# EAGLE design Tema_proiect_v15 (EAGLE 9.7.0)
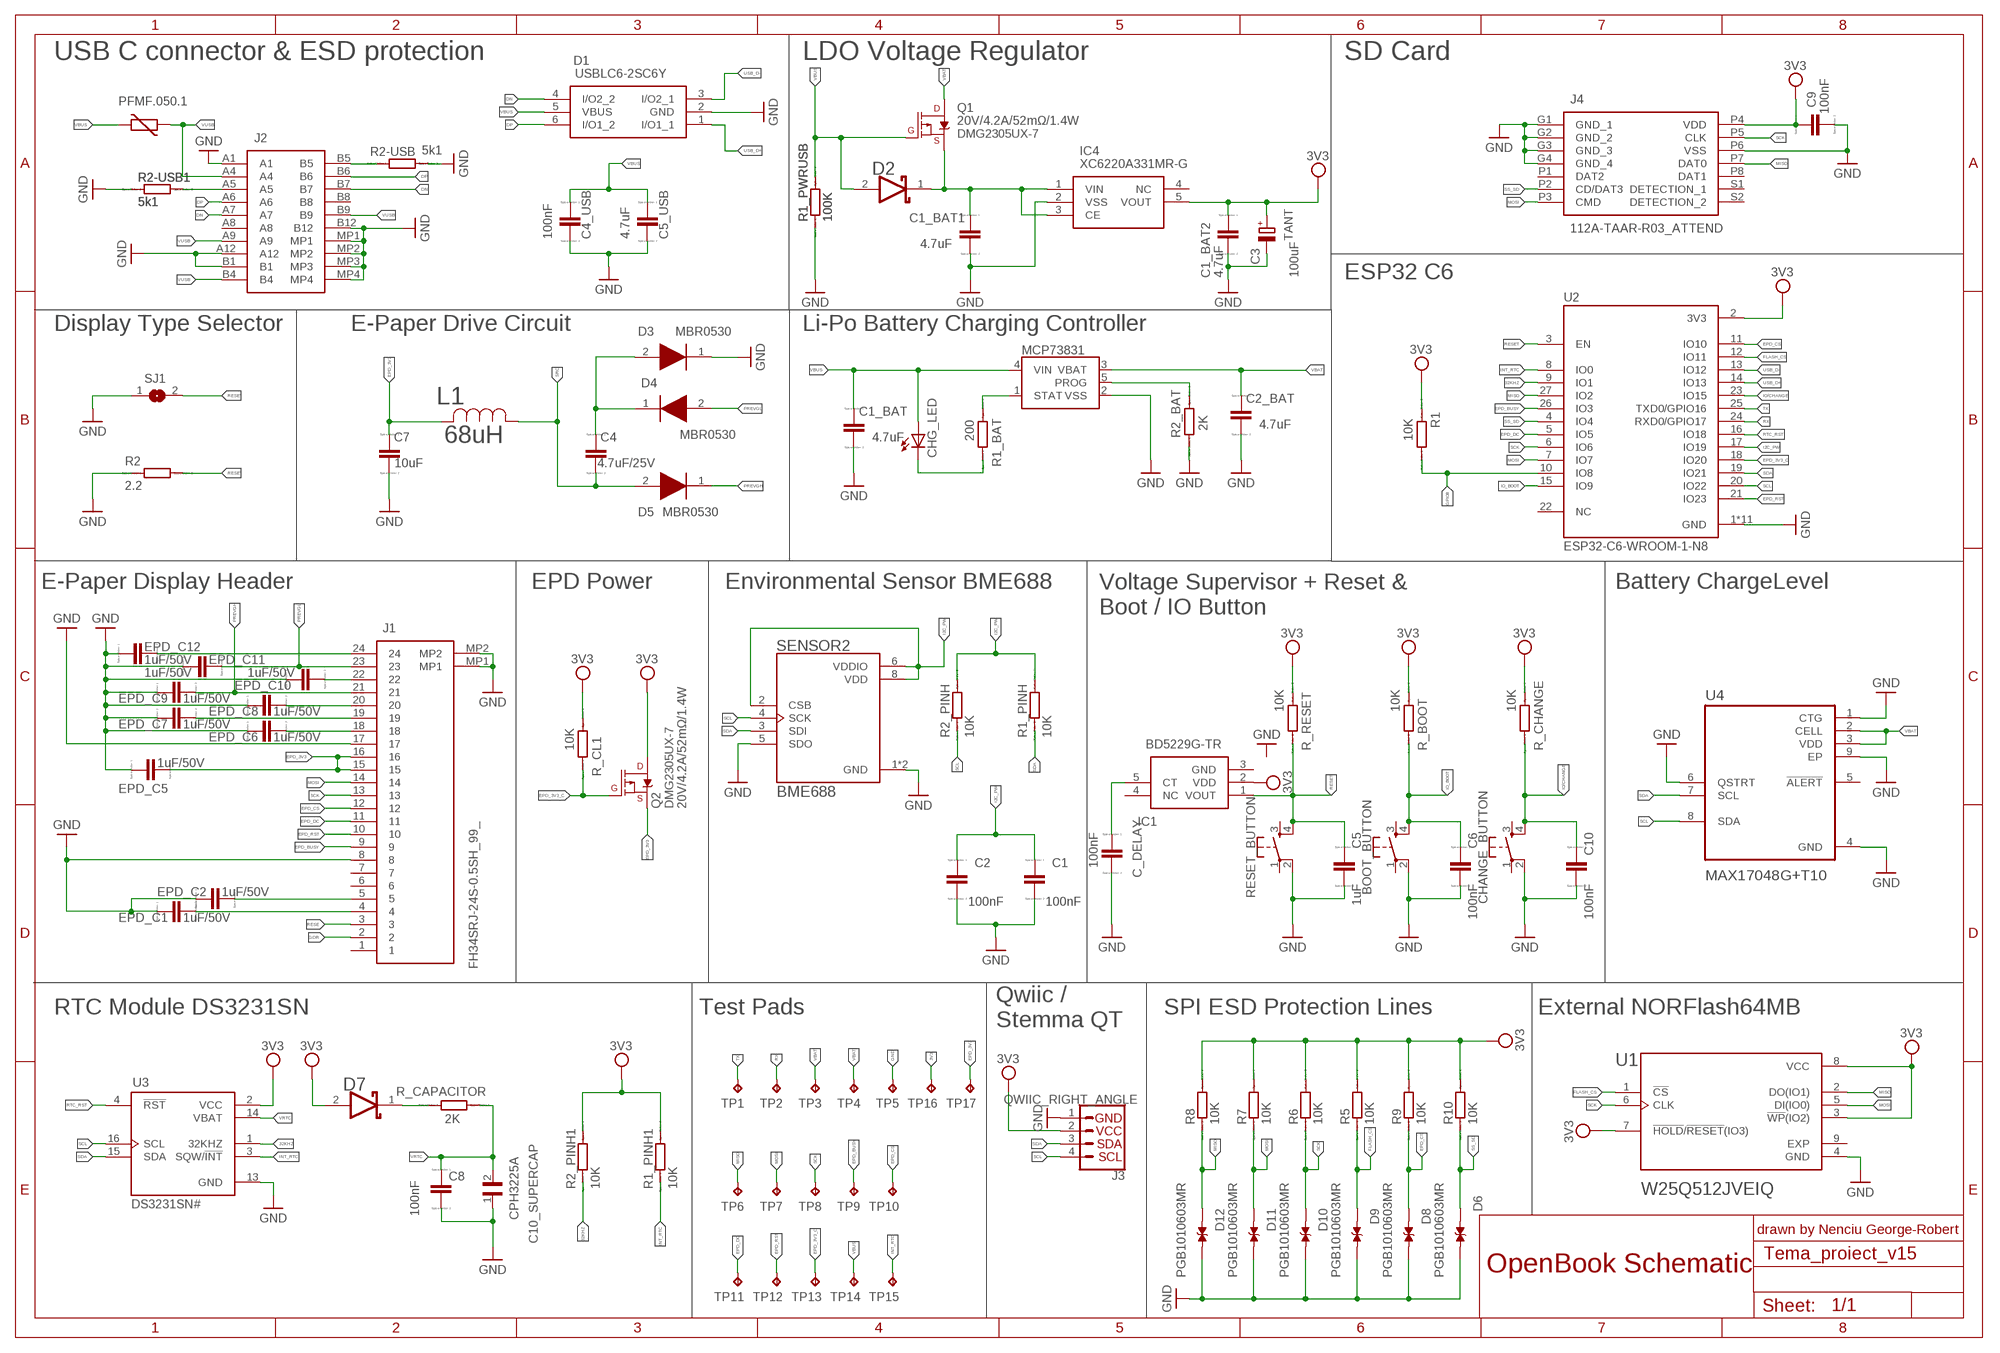
[diagram p0: schematic, sheet 1]

## Parts
BOOT_BUTTON  BUTTON_CUSYOMV1  [MYBUTTON]
C1  100nF  EAGLE-LTSPICE_CC0402  [EAGLE-LTSPICE_C0402]
C1_BAT  4.7uF  EAGLE-LTSPICE_CC0402  [EAGLE-LTSPICE_C0402]
C1_BAT1  4.7uF  EAGLE-LTSPICE_CC0402  [EAGLE-LTSPICE_C0402]
C1_BAT2  4.7uF  EAGLE-LTSPICE_CC0402  [EAGLE-LTSPICE_C0402]
C2  100nF  EAGLE-LTSPICE_CC0402  [EAGLE-LTSPICE_C0402]
C2_BAT  4.7uF  EAGLE-LTSPICE_CC0402  [EAGLE-LTSPICE_C0402]
C3  100uF  RCL_CPOL-EUCT3528  [RCL_CT3528]
C4  4.7uF/25V  EAGLE-LTSPICE_CC0402  [EAGLE-LTSPICE_C0402]
C4_USB  100nF  EAGLE-LTSPICE_CC0402  [EAGLE-LTSPICE_C0402]
C5  1uF  EAGLE-LTSPICE_CC0402  [EAGLE-LTSPICE_C0402]
C5_USB  4.7uF  EAGLE-LTSPICE_CC0402  [EAGLE-LTSPICE_C0402]
C6  100nF  EAGLE-LTSPICE_CC0402  [EAGLE-LTSPICE_C0402]
C7  10uF  EAGLE-LTSPICE_CC0402  [EAGLE-LTSPICE_C0402]
C8  100nF  EAGLE-LTSPICE_CC0402  [EAGLE-LTSPICE_C0402]
C9  100nF  EAGLE-LTSPICE_CC0402  [EAGLE-LTSPICE_C0402]
C10  100nF  EAGLE-LTSPICE_CC0402  [EAGLE-LTSPICE_C0402]
C10_SUPERCAP  CPH3225A  [CAPCP3225X100N]
C_DELAY  100nF  EAGLE-LTSPICE_CC0402  [EAGLE-LTSPICE_C0402]
CHANGE_BUTTON  BUTTON_CUSYOMV1  [MYBUTTON]
CHG_LED  ADAFRUIT_LEDCHIP-LED0603  [ADAFRUIT_CHIP-LED0603]
D1  USBLC6-2SC6Y  [SOT95P280X145-6N]
D2  ESP32_WROVER_AVX---SD0805S020S1R0_AVX_SD0805S020S1R0_0_0AVX_SD0805S020S1R0_0_0  [ESP32_WROVER_AVX---SD0805S020S1R0_AVX_SD0805S020S1R0_0]
D3  MBR0530  [SOD3716X135N]
D4  MBR0530  [SOD3716X135N]
D5  MBR0530  [SOD3716X135N]
D6  PGB1010603MR  [DIOC1608X36N]
D7  ESP32_WROVER_AVX---SD0805S020S1R0_AVX_SD0805S020S1R0_0_0AVX_SD0805S020S1R0_0_0  [ESP32_WROVER_AVX---SD0805S020S1R0_AVX_SD0805S020S1R0_0]
D8  PGB1010603MR  [DIOC1608X36N]
D9  PGB1010603MR  [DIOC1608X36N]
D10  PGB1010603MR  [DIOC1608X36N]
D11  PGB1010603MR  [DIOC1608X36N]
D12  PGB1010603MR  [DIOC1608X36N]
EPD_C1  1uF/50V  EAGLE-LTSPICE_CC0402  [EAGLE-LTSPICE_C0402]
EPD_C2  1uF/50V  EAGLE-LTSPICE_CC0402  [EAGLE-LTSPICE_C0402]
EPD_C5  1uF/50V  EAGLE-LTSPICE_CC0402  [EAGLE-LTSPICE_C0402]
EPD_C6  1uF/50V  EAGLE-LTSPICE_CC0402  [EAGLE-LTSPICE_C0402]
EPD_C7  1uF/50V  EAGLE-LTSPICE_CC0402  [EAGLE-LTSPICE_C0402]
EPD_C8  1uF/50V  EAGLE-LTSPICE_CC0402  [EAGLE-LTSPICE_C0402]
EPD_C9  1uF/50V  EAGLE-LTSPICE_CC0402  [EAGLE-LTSPICE_C0402]
EPD_C10  1uF/50V  EAGLE-LTSPICE_CC0402  [EAGLE-LTSPICE_C0402]
EPD_C11  1uF/50V  EAGLE-LTSPICE_CC0402  [EAGLE-LTSPICE_C0402]
EPD_C12  1uF/50V  EAGLE-LTSPICE_CC0402  [EAGLE-LTSPICE_C0402]
IC1  BD5229G-TR  [SOT95P280X125-5N]
IC4  XC6220A331MR-G  [SOT95P280X120-5N]
J1  FH34SRJ-24S-0.5SH_99_  [FH34SRJ24S05SH99]
J2  SAMACSYS_PARTS_USB4110-GF-A  [SAMACSYS_PARTS_USB4110GFA]
J3  QWIIC_RIGHT_ANGLE  QWIIC_CONNECTORJS-1MM  [JST04_1MM_RA]
J4  112A-TAAR-R03_ATTEND  [112ATAARR03ATTEND]
L1  68uH  744043680IND_4828-WE-TPC_WRE  [IND_4828-WE-TPC_WRE]
MCP73831  ESP32_WROVER_SPARKFUN-IC-POWER_MCP73831  [ESP32_WROVER_SPARKFUN-IC-POWER_SOT23-5]
PFMF.050.1  ESP32C6_VARISTORCN1812  [ESP32C6_VARISTOR_CT/CN1812]
Q1  20V/4.2A/52mΩ/1.4W  ESP32_WROVER_SPARKFUN-DISCRETESEMI_MOSFET_PCH-DMG2305UX-7  [ESP32_WROVER_SPARKFUN-DISCRETESEMI_SOT23-3]
Q2  20V/4.2A/52mΩ/1.4W  ESP32_WROVER_SPARKFUN-DISCRETESEMI_MOSFET_PCH-DMG2305UX-7  [ESP32_WROVER_SPARKFUN-DISCRETESEMI_SOT23-3]
R1  10K  ESP32_WROVER_EAGLE-LTSPICE_RR0402  [ESP32_WROVER_EAGLE-LTSPICE_R0402]
R1_BAT  200  ESP32_WROVER_EAGLE-LTSPICE_RR0402  [ESP32_WROVER_EAGLE-LTSPICE_R0402]
R1_PINH  10K  ESP32_WROVER_EAGLE-LTSPICE_RR0402  [ESP32_WROVER_EAGLE-LTSPICE_R0402]
R1_PINH1  10K  ESP32_WROVER_EAGLE-LTSPICE_RR0402  [ESP32_WROVER_EAGLE-LTSPICE_R0402]
R1_PWRUSB  100K  ESP32_WROVER_EAGLE-LTSPICE_RR0402  [ESP32_WROVER_EAGLE-LTSPICE_R0402]
R2  2.2  ESP32_WROVER_EAGLE-LTSPICE_RR0402  [ESP32_WROVER_EAGLE-LTSPICE_R0402]
R2-USB  5k1  ESP32_WROVER_EAGLE-LTSPICE_RR0402  [ESP32_WROVER_EAGLE-LTSPICE_R0402]
R2-USB1  5k1  ESP32_WROVER_EAGLE-LTSPICE_RR0402  [ESP32_WROVER_EAGLE-LTSPICE_R0402]
R2_BAT  2K  ESP32_WROVER_EAGLE-LTSPICE_RR0402  [ESP32_WROVER_EAGLE-LTSPICE_R0402]
R2_PINH  10K  ESP32_WROVER_EAGLE-LTSPICE_RR0402  [ESP32_WROVER_EAGLE-LTSPICE_R0402]
R2_PINH1  10K  ESP32_WROVER_EAGLE-LTSPICE_RR0402  [ESP32_WROVER_EAGLE-LTSPICE_R0402]
R5  10K  ESP32_WROVER_EAGLE-LTSPICE_RR0402  [ESP32_WROVER_EAGLE-LTSPICE_R0402]
R6  10K  ESP32_WROVER_EAGLE-LTSPICE_RR0402  [ESP32_WROVER_EAGLE-LTSPICE_R0402]
R7  10K  ESP32_WROVER_EAGLE-LTSPICE_RR0402  [ESP32_WROVER_EAGLE-LTSPICE_R0402]
R8  10K  ESP32_WROVER_EAGLE-LTSPICE_RR0402  [ESP32_WROVER_EAGLE-LTSPICE_R0402]
R9  10K  ESP32_WROVER_EAGLE-LTSPICE_RR0402  [ESP32_WROVER_EAGLE-LTSPICE_R0402]
R10  10K  ESP32_WROVER_EAGLE-LTSPICE_RR0402  [ESP32_WROVER_EAGLE-LTSPICE_R0402]
R_BOOT  10K  ESP32_WROVER_EAGLE-LTSPICE_RR0402  [ESP32_WROVER_EAGLE-LTSPICE_R0402]
R_CAPACITOR  2K  ESP32_WROVER_EAGLE-LTSPICE_RR0402  [ESP32_WROVER_EAGLE-LTSPICE_R0402]
R_CHANGE  10K  ESP32_WROVER_EAGLE-LTSPICE_RR0402  [ESP32_WROVER_EAGLE-LTSPICE_R0402]
R_CL1  10K  ESP32_WROVER_EAGLE-LTSPICE_RR0402  [ESP32_WROVER_EAGLE-LTSPICE_R0402]
R_RESET  10K  ESP32_WROVER_EAGLE-LTSPICE_RR0402  [ESP32_WROVER_EAGLE-LTSPICE_R0402]
RESET_BUTTON  BUTTON_CUSYOMV1  [MYBUTTON]
SENSOR2  BME688  ESP32_WROVER_BME680_BME680  [ESP32_WROVER_BME680_PSON80P300X300X100-8N]
SJ1  SJ  [SJ]
TP1  TPTP20R  [TP20R]
TP2  TPTP20R  [TP20R]
TP3  TPTP20R  [TP20R]
TP4  TPTP20R  [TP20R]
TP5  TPTP20R  [TP20R]
TP6  TPTP20R  [TP20R]
TP7  TPTP20R  [TP20R]
TP8  TPTP20R  [TP20R]
TP9  TPTP20R  [TP20R]
TP10  TPTP20R  [TP20R]
TP11  TPTP20R  [TP20R]
TP12  TPTP20R  [TP20R]
TP13  TPTP20R  [TP20R]
TP14  TPTP20R  [TP20R]
TP15  TPTP20R  [TP20R]
TP16  TPTP20R  [TP20R]
TP17  TPTP20R  [TP20R]
U1  W25Q512JVEIQ  [SON127P600X800X80-9N]
U2  ESP32-C6-WROOM-1-N8  [XCVR_ESP32-C6-WROOM-1-N8]
U3  DS3231SN#  [SOIC127P1032X265-16N]
U4  MAX17048G+T10  [SON50P200X200X80-9N]

## Nets
3V3: C1_BAT2.1 C3.+ C9.1 D7.2(ANODE) IC1.2(VDD) IC4.5(VOUT) J3.2 J4.P4(VDD) Q2.3(D) R1.2 R1_PINH1.2 R2_PINH1.2 R5.2 R6.2 R7.2 R8.2 R9.2 R10.2 R_BOOT.2 R_CHANGE.2 R_CL1.2 R_RESET.2 TP16.TP U1.3(!WP!(IO2)) U1.7(!HOLD!/!RESET!(IO3)) U1.8(VCC) U2.2(3V3) U3.2(VCC)
32KHZ: R2_PINH1.1 U2.9(IO1) U3.1(32KHZ)
DN: D1.4(I/O2_2) J2.A7 J2.B7
DP: D1.6(I/O1_2) J2.A6 J2.B6
EPD_3V3: C7.1 L1.2 Q2.2(S) TP17.TP
EPD_3V3_C: TP13.TP U2.18(IO20)
EPD_BUSY: J1.9 TP9.TP U2.26(IO3)
EPD_CS: D8.1 J1.12 R9.1 TP10.TP U2.11(IO10)
EPD_DC: J1.11 TP11.TP U2.5(IO5)
EPD_RST: J1.10 TP12.TP U2.21(IO23)
FLASH_CS: D9.1 R5.1 U1.1(!CS) U2.12(IO11)
GDR: J1.2
GND: BOOT_BUTTON.2 C1.2 C1_BAT1.2 C1_BAT2.2 C1_BAT.2 C2.2 C2_BAT.2 C3.- C4_USB.2 C5.2 C5_USB.2 C6.2 C7.2 C8.2 C9.2 C10.2 C10_SUPERCAP.1 C_DELAY.2 CHANGE_BUTTON.2 D1.2(GND) D3.1(K) D6.2 D8.2 D9.2 D10.2 D11.2 D12.2 EPD_C1.1 EPD_C2.1 EPD_C5.1 EPD_C6.1 EPD_C7.1 EPD_C8.1 EPD_C9.1 EPD_C10.1 EPD_C11.1 EPD_C12.1 IC4.2(VSS) J1.8 J1.17 J1.MP1 J1.MP2 J2.A1 J2.A12 J2.B1 J2.B12 J2.MP1 J2.MP2 J2.MP3 J2.MP4 J3.1 J4.G1(GND_1) J4.G2(GND_2) J4.G3(GND_3) J4.G4(GND_4) J4.P6(VSS) MCP73831.2(VSS) R1_PWRUSB.1 R2-USB1.1 R2-USB.2 R2.1 R2_BAT.2 RESET_BUTTON.2 SENSOR2.1(GND) SENSOR2.5(SDO) SENSOR2.7(GND) SJ1.1 TP5.TP U1.4(GND) U2.1(GND) U2.28(GND) U2.29_1(GND) U2.29_2(GND) U2.29_3(GND) U2.29_4(GND) U2.29_5(GND) U2.29_6(GND) U2.29_7(GND) U2.29_8(GND) U2.29_9(GND) U3.13(GND) U4.1(CTG) U4.4(GND) U4.6(QSTRT) U4.9(EP)
GPIO8: R1.1 U2.10(IO8)
I2C_PW: U2.17(IO19)
INT_RTC: R1_PINH1.1 TP15.TP U2.8(IO0) U3.3(SQW/!INT)
IO/CHANGE: U2.23(IO15)
IO_BOOT: U2.15(IO9)
MISO: D12.1 J4.P7(DAT0) R8.1 TP6.TP U1.2(DO(IO1)) U2.27(IO2)
MOSI: D11.1 J1.14 J4.P3(CMD) R7.1 TP7.TP U1.5(DI(IO0)) U2.7(IO7)
N$1: J2.A5 R2-USB1.2
N$2: J2.B5 R2-USB.1
N$20: C1_BAT1.1 D2.1(CATHODE) IC4.1(VIN) IC4.3(CE) Q1.2(S)
N$25: C4.1 D3.2(A) D4.1(K)
N$30: MCP73831.1(STAT) R1_BAT.2
N$31: CHG_LED.C R1_BAT.1
N$32: MCP73831.5(PROG) R2_BAT.1
N$60: EPD_C12.2 J1.24
N$61: EPD_C11.2 J1.23
N$62: EPD_C10.2 J1.22
N$63: EPD_C9.2 J1.21
N$64: EPD_C8.2 J1.20
N$65: EPD_C7.2 J1.19
N$66: EPD_C6.2 J1.18
N$67: EPD_C5.2 J1.15 J1.16
N$74: EPD_C2.2 J1.5
N$75: EPD_C1.2 J1.4
N$78: Q2.1(G) R_CL1.1
N$82: R1_PINH.2 R2_PINH.2
N$83: SENSOR2.2(CSB) SENSOR2.6(VDDIO) SENSOR2.8(VDD)
N$86: C1.1 C2.1
N$87: C5.1 IC1.1(VOUT) R_RESET.1 RESET_BUTTON.4
N$88: BOOT_BUTTON.4 C6.1 R_BOOT.1
N$89: C10.1 CHANGE_BUTTON.4 R_CHANGE.1
N$90: C_DELAY.1 IC1.5(CT)
N$100: D7.1(CATHODE) R_CAPACITOR.2
N$101: C8.1 C10_SUPERCAP.2 R_CAPACITOR.1
PREVGH: D5.1(K)
PREVGL: D4.2(A)
RESE: J1.3
RESE': R2.2 SJ1.2
RESET: U2.3(EN)
RTC_RST: U2.16(IO18) U3.4(!RST)
RX: TP2.TP U2.24(RXD0/GPIO17)
SCK: D10.1 J1.13 J4.P5(CLK) R6.1 TP8.TP U1.6(CLK) U2.6(IO6)
SCL: J3.4 R2_PINH.1 SENSOR2.4(SCK) U2.20(IO22) U3.16(SCL) U4.8(SDA)
SDA: J3.3 R1_PINH.1 SENSOR2.3(SDI) U2.19(IO21) U3.15(SDA) U4.7(SCL)
SRC: C4.2 D5.2(A) L1.1
SS_SD: D6.1 J4.P2(CD/DAT3) R10.1 U2.4(IO4)
TX: TP1.TP U2.25(TXD0/GPIO16)
USB_D+: D1.1(I/O1_1) U2.14(IO13)
USB_D-: D1.3(I/O2_1) U2.13(IO12)
VBAT: C2_BAT.1 MCP73831.3(VBAT) Q1.3(D) TP3.TP TP4.TP U4.2(CELL) U4.3(VDD)
VBUS: C1_BAT.1 C4_USB.1 C5_USB.1 CHG_LED.A D1.5(VBUS) D2.2(ANODE) MCP73831.4(VIN) PFMF.050.1.2 Q1.1(G) R1_PWRUSB.2 TP14.TP
VRTC: U3.14(VBAT)
VUSB: J2.A4 J2.A9 J2.B4 J2.B9 PFMF.050.1.1
Unconnected: BOOT_BUTTON.1 BOOT_BUTTON.3 CHANGE_BUTTON.1 CHANGE_BUTTON.3 IC1.3(GND) IC1.4(NC) IC4.4(NC) J1.1 J1.6 J1.7 J2.A8 J2.B8 J4.P1(DAT2) J4.P8(DAT1) J4.S1(DETECTION_1) J4.S2(DETECTION_2) RESET_BUTTON.1 RESET_BUTTON.3 U1.9(EXP) U2.22(NC) U4.5(!ALERT)

## Notes on the sheet
- USB C connector & ESD protection | LDO Voltage Regulator | SD Card
- DMG2305UX-7
- TANT
- ESP32 C6
- Display Type Selector | E-Paper Drive Circuit | Li-Po Battery Charging Controller
- E-Paper Display Header | EPD Power | Environmental Sensor BME688 | Battery ChargeLevel
- Voltage Supervisor + Reset &
  Boot / IO Button
- DMG2305UX-7
- RTC Module DS3231SN | Test Pads | SPI ESD Protection Lines | External NORFlash64MB
- Qwiic /
  Stemma QT
- drawn by Nenciu George-Robert
- OpenBook Schematic

## Library data of the parts
BOOT_BUTTON CHANGE_BUTTON RESET_BUTTON = DeskAssistant_v19_v1:BUTTON_CUSYOMV1
C1 C1_BAT C1_BAT1 C1_BAT2 C2 C2_BAT C4 C4_USB C5 C5_USB C6-C10 C_DELAY EPD_C1 EPD_C2 EPD_C5-EPD_C12 = DeskAssistant_v19_v1:EAGLE-LTSPICE_C: CAPACITOR, European symbol; SPICEMODEL: NONE; SPICEPREFIX: C
C3 = DeskAssistant_v19_v1:RCL_CPOL-EU: POLARIZED CAPACITOR, European symbol; SPICEPREFIX: C
C10_SUPERCAP = DeskAssistant_v19_v1:CPH3225A: Cap 0.011F 3.3V 1210 Flat Check availability <https://pricing.snapeda.com/parts/CPH3225A/Seiko%20Instruments/view-part?ref=eda>; AVAILABILITY: Not in stock; CHECK_PRICES: https://www.snapeda.com/parts/CPH3225A/Seiko+Instruments/view-part/?ref=eda; DESCRIPTION: 11 mF (EDLC) Supercapacitor 3.3 V 1210 (3225 Metric) - -; MF: Seiko Instruments; MP: CPH3225A; PACKAGE: 1210 Seiko; PRICE: None; PURCHASE-URL: https://www.snapeda.com/api/url_track_click_mouser/?unipart_id=562593&manufacturer=Seiko Instruments&part_name=CPH3225A&search_term=None; SNAPEDA_LINK: https://www.snapeda.com/parts/CPH3225A/Seiko+Instruments/view-part/?ref=snap
CHG_LED = DeskAssistant_v19_v1:ADAFRUIT_LED: LED OSRAM: - CHIPLED LG R971, LG N971, LY N971, LG Q971, LY Q971, LO R971, LY R971 LH N974, LH R974 LS Q976, LO Q976, LY Q976 LO Q996 - Hyper CHIPLED LW Q18S LB Q993, LB Q99A, LB R99A - SideLED LS A670, LO A670, LY A670, LG A670, LP A670 LB A673, LV A673, LT A673, LW A673 LH A674 LY A675 LS A676, LA A676, LO A676, LY A676, LW A676 LS A679, LY A679, LG A679 - Hyper Micro SIDELED® LS Y876, LA Y876, LO Y876, LY Y876 LT Y87S - SmartLED LW L88C, LW L88S LB L89C, LB L89S, LG L890 LS L89K, LO L89K, LY L89K LS L896, LA L896, LO L896, LY L896 - TOPLED LS T670, LO T670, LY T670, LG T670, LP T670 LSG T670, LSP T670, LSY T670, LOP T670, LYG T670 LG T671, LOG T671, LSG T671 LB T673, LV T673, LT T673, LW T673 LH T674 LS T676, LA T676, LO T676, LY T676, LB T676, LH T676, LSB T676, LW T676 LB T67C, LV T67C, LT T67C, LS T67K, LO T67K, LY T67K, LW E67C LS E67B, LA E67B, LO E67B, LY E67B, LB E67C, LV E67C, LT E67C LW T67C LS T679, LY T679, LG T679 LS T770, LO T770, LY T770, LG T770, LP T770 LB T773, LV T773, LT T773, LW T773 LH T774 LS E675, LA E675, LY E675, LS T675 LS T776, LA T776, LO T776, LY T776, LB T776 LHGB T686 LT T68C, LB T68C - Hyper Mini TOPLED® LB M676 - Mini TOPLED Santana® LG M470 LS M47K, LO M47K, LY M47K Source: http://www.osram.convergy.de/
D1 = DeskAssistant_v19_v1:USBLC6-2SC6Y: Low Cap. ESD Protection Auto SOT-23-6 STMicroelectronics USBLC6-2SC6Y, Dual Uni-Directional TVS Diode Array, 6-Pin SOT-23 Source: Datasheet <https://componentsearchengine.com/Datasheets/1/USBLC6-2SC6Y.pdf> Check availability <https://pricing.snapeda.com/parts/USBLC6-2SC6Y/STMicroelectronics/view-part?ref=eda>; AVAILABILITY: In Stock; CHECK_PRICES: https://www.snapeda.com/parts/USBLC6-2SC6Y/STMicroelectronics/view-part/?ref=eda; DESCRIPTION: 17V Clamp 5A (8/20µs) Ipp Tvs Diode Surface Mount SOT-23-6; MF: STMicroelectronics; MP: USBLC6-2SC6Y; PACKAGE: SOT-23-6 STMicroelectronics; PRICE: None; SNAPEDA_LINK: https://www.snapeda.com/parts/USBLC6-2SC6Y/STMicroelectronics/view-part/?ref=snap
D2 D7 = DeskAssistant_v19_v1:ESP32_WROVER_AVX---SD0805S020S1R0_AVX_SD0805S020S1R0_0_0: Schottky Barrier Rectifier Diode; CENTROID_NOT_SPECIFIED: No; DATASHEET: http://datasheets.avx.com/schottky.pdf; DIGIKEY_DESCRIPTION: DIODE SCHOTTKY 20V 1A 0805; DIGIKEY_PART_NUMBER: 478-7800-1-ND; LEAD_FREE: yes; MF: AVX; MOUSER_PART_NUMBER: 581-SD0805S020S1R0; PACKAGE: 0805 (2012 metric); PREFIX: D; ROHS: yes; TEMPERATURE_RANGE_HIGH: +125°C; TEMPERATURE_RANGE_LOW: -55°C
D3-D5 = DeskAssistant_v19_v1:MBR0530: ON SEMICONDUCTOR - MBR0530 - DIODE, SCHOTTKY, 0.5A, 30V, SOD-123 Source: Datasheet <http://www.onsemi.com/pub/Collateral/MBR0530T1-D.PDF> Check availability <https://pricing.snapeda.com/parts/MBR0530/ON%20Semiconductor/view-part?ref=eda>; AVAILABILITY: In Stock; CHECK_PRICES: https://www.snapeda.com/parts/MBR0530/Onsemi/view-part/?ref=eda; DESCRIPTION: Diode Schottky 30 V 500mA Surface Mount SOD-123; MF: ON Semiconductor; MP: MBR0530; PACKAGE: SOD-123-2 ON Semiconductor; PRICE: None; PURCHASE-URL: https://www.snapeda.com/api/url_track_click_mouser/?unipart_id=179458&manufacturer=ON Semiconductor&part_name=MBR0530&search_term=None; SNAPEDA_LINK: https://www.snapeda.com/parts/MBR0530/Onsemi/view-part/?ref=snap
D6 D8-D12 = DeskAssistant_v19_v1:PGB1010603MR: Check availability <https://pricing.snapeda.com/parts/PGB1010603MR/Littelfuse%20Inc./view-part?ref=eda>; AVAILABILITY: In Stock; CHECK_PRICES: https://www.snapeda.com/parts/PGB1010603MR/Littelfuse/view-part/?ref=eda; DESCRIPTION: 150V (Typ) Clamp - Ipp Tvs Diode Surface Mount 0603 (1608 Metric); MF: Littelfuse Inc.; MP: PGB1010603MR; PACKAGE: 0603 Littelfuse Inc.; PRICE: None; PURCHASE-URL: https://www.snapeda.com/api/url_track_click_mouser/?unipart_id=5659453&manufacturer=Littelfuse Inc.&part_name=PGB1010603MR&search_term=None; SNAPEDA_LINK: https://www.snapeda.com/parts/PGB1010603MR/Littelfuse/view-part/?ref=snap
IC1 = DeskAssistant_v19_v1:BD5229G-TR: Voltage Detector with Adjustable Delay Time: CMOS processes are utilized to develop high precision, low current consumption CMOS reset ICs that allow arbitrary setting of the delay time. The extensive lineup includes both Nch Open Drain and CMOS output types in a wide range of detection voltages (from 2.3V to 6.0V, in 0.1V steps), enabling selection of the ideal solution based on customer requirements. In addition, the entire series is of course both lead-free and RoHS-compliant. Source: Datasheet <https://datasheet.datasheetarchive.com/originals/distributors/Datasheets_SAMA/f2b9741ef86007909f138d561a359946.pdf>; DESCRIPTION: Voltage Detector with Adjustable Delay Time: CMOS processes are utilized to develop high precision, low current consumption CMOS reset ICs that allow arbitrary setting of the delay time. The extensive lineup includes both Nch Open Drain and CMOS output types in a wide range of detection voltages (from 2.3V to 6.0V, in 0.1V steps), enabling selection of the ideal solution based on customer requirements. In addition, the entire series is of course both lead-free and RoHS-compliant.; HEIGHT: 1.25mm; MANUFACTURER_NAME: ROHM Semiconductor; MANUFACTURER_PART_NUMBER: BD5229G-TR; MOUSER_PART_NUMBER: 755-BD5229G-TR; MOUSER_PRICE-STOCK: https://www.mouser.co.uk/ProductDetail/ROHM-Semiconductor/BD5229G-TR?qs=4kLU8WoGk0vvnhrrYwdszw%3D%3D
IC4 = DeskAssistant_v19_v1:XC6220A331MR-G: LDO Voltage Regulators Source: Datasheet <https://www.torexsemi.com/file/xc6220/XC6220.pdf>; DESCRIPTION: LDO Voltage Regulators; HEIGHT: 1.2mm; MANUFACTURER_NAME: Torex; MANUFACTURER_PART_NUMBER: XC6220A331MR-G; MOUSER_PART_NUMBER: 865-XC6220A331MR-G; MOUSER_PRICE-STOCK: https://www.mouser.co.uk/ProductDetail/Torex-Semiconductor/XC6220A331MR-G?qs=AsjdqWjXhJ8ZSWznL1J0gg%3D%3D
J1 = DeskAssistant_v19_v1:FH34SRJ-24S-0.5SH_99_: 24 Position FFC, FPC Connector Contacts, Top and Bottom 0.020" (0.50mm) Surface Mount, Right Angle Source: Datasheet <https://www.hirose.com/en/product/document?clcode=CL0580-1255-6-99&productname=FH34SRJ-24S-0.5SH(99)&series=FH34SRJ&documenttype=2DDrawing&lang=en&documentid=0000990903>; DESCRIPTION: 24 Position FFC, FPC Connector Contacts, Top and Bottom 0.020" (0.50mm) Surface Mount, Right Angle; HEIGHT: 1.1mm; MANUFACTURER_NAME: Hirose; MANUFACTURER_PART_NUMBER: FH34SRJ-24S-0.5SH(99); MOUSER_PART_NUMBER: 798-FH34SRJ24S05SH99; MOUSER_PRICE-STOCK: https://www.mouser.co.uk/ProductDetail/Hirose-Connector/FH34SRJ-24S-0.5SH99?qs=vcbW%252B4%252BSTIpKBl5ap9J8Fw%3D%3D
J2 = DeskAssistant_v19_v1:SAMACSYS_PARTS_USB4110-GF-A: CONN USB 2.0 TYPE-C R/A SMT Source: Datasheet <https://gct.co/files/drawings/usb4110.pdf>; DESCRIPTION: CONN USB 2.0 TYPE-C R/A SMT; HEIGHT: 3.26mm; MANUFACTURER_NAME: GCT (GLOBAL CONNECTOR TECHNOLOGY); MANUFACTURER_PART_NUMBER: USB4110-GF-A; MOUSER_PART_NUMBER: 640-USB4110-GF-A; MOUSER_PRICE-STOCK: https://www.mouser.co.uk/ProductDetail/GCT/USB4110-GF-A?qs=KUoIvG%2F9IlYiZvIXQjyJeA%3D%3D
J3 = DeskAssistant_v19_v1:QWIIC_CONNECTOR: SparkFun I2C Standard Qwiic Connector An SMD 1mm pitch JST connector makes it easy and quick (get it? Qwiic?) to connect I2C devices to each other. The Qwiic system <http://www.sparkfun.com/qwiic> enables fast and solderless connection between popular platforms and various sensors and actuators. We carry 200mm <https://www.sparkfun.com/products/14204>, 100mm <https://www.sparkfun.com/products/14205>, 50mm <https://www.sparkfun.com/products/14206>, and breadboard friendly <https://www.sparkfun.com/products/14207> Qwiic cables. We also offer 10 pcs strips <https://www.sparkfun.com/products/14323> the SMD connectors.; PROD_ID: CONN-13694
J4 = DeskAssistant_v19_v1:112A-TAAR-R03_ATTEND: Micro SD Card Socket, Push-Push Type, Top Mount, SMT, H=1.83mm, 10u Source: Datasheet <https://www.attend.com.tw/data/download/file/112A-TAAR-R03.pdf>; DESCRIPTION: Micro SD Card Socket, Push-Push Type, Top Mount, SMT, H=1.83mm, 10u; HEIGHT: 1.9mm; MANUFACTURER_NAME: ATTEND; MANUFACTURER_PART_NUMBER: 112A-TAAR-R03 ATTEND
L1 = DeskAssistant_v19_v1:744043680; COPYRIGHT: Copyright (C) 2024 Ultra Librarian. All rights reserved.; MANUFACTURER_PART_NUMBER: 744043680; MFR_NAME: Wurth Electronics
MCP73831 = DeskAssistant_v19_v1:ESP32_WROVER_SPARKFUN-IC-POWER_MCP73831: MCP73831T Li-Ion, Li-Pol Controller Miniature single cell, fully integrated Li-Ion, Li-polymer charge management controller Datasheet <http://ww1.microchip.com/downloads/en/DeviceDoc/20001984g.pdf> SparkFun Products: SparkFun ESP32 Thing <https://www.sparkfun.com/products/13907> SparkFun 9DoF Razor IMU M0 <https://www.sparkfun.com/products/14001>; PROD_ID: IC-09995
PFMF.050.1 = DeskAssistant_v19_v1:ESP32C6_VARISTOR: VARISTOR
Q1 Q2 = DeskAssistant_v19_v1:ESP32_WROVER_SPARKFUN-DISCRETESEMI_MOSFET_PCH: P-channel MOSFETs Voltage controlled devices that allow control of high current outputs. SparkFun Products: SparkFun ESP32 Thing <https://www.sparkfun.com/products/13907> SparkFun ESP8266 Thing <https://www.sparkfun.com/products/13231> SparkFun Pi Servo HAT V2 <https://www.sparkfun.com/products/15316> DMG2305UX-7 (20V/4.2A/SOT23-3); PROD_ID: TRAN-14388
R1 R1_BAT R1_PINH R1_PINH1 R1_PWRUSB R2 R2-USB R2-USB1 R2_BAT R2_PINH R2_PINH1 R5-R10 R_BOOT R_CAPACITOR R_CHANGE R_CL1 R_RESET = DeskAssistant_v19_v1:ESP32_WROVER_EAGLE-LTSPICE_R: RESISTOR, European symbol; SPICEMODEL: NONE; SPICEPREFIX: R
SENSOR2 = DeskAssistant_v19_v1:ESP32_WROVER_BME680_BME680: Integrated Environmental Unit; AVAILABILITY: Unavailable; DESCRIPTION: Integrated Environmental Unit; MF: Bosch Sensortec; MP: BME680; PACKAGE: LGA-8 Bosch Tools; PRICE: None
SJ1 = DeskAssistant_v19_v1:SJ: SMD solder JUMPER
TP1-TP17 = DeskAssistant_v19_v1:TP: Test pad
U1 = DeskAssistant_v19_v1:W25Q512JVEIQ: Check availability <https://pricing.snapeda.com/parts/W25Q512JVEIQ/Winbond%20Electronics/view-part?ref=eda>; AVAILABILITY: In Stock; CHECK_PRICES: https://www.snapeda.com/parts/W25Q512JVEIQ/Winbond+Electronics/view-part/?ref=eda; DESCRIPTION: FLASH - NOR Memory IC 512Mb (64M x 8) SPI - Quad I/O 133 MHz 8-WSON (8x6); MF: Winbond Electronics; MP: W25Q512JVEIQ; PACKAGE: Package; PRICE: None; SNAPEDA_LINK: https://www.snapeda.com/parts/W25Q512JVEIQ/Winbond+Electronics/view-part/?ref=snap
U2 = DeskAssistant_v19_v1:ESP32-C6-WROOM-1-N8: Check availability <https://pricing.snapeda.com/parts/ESP32-C6-WROOM-1-N8/Espressif%20Systems/view-part?ref=eda>; AVAILABILITY: In Stock; CHECK_PRICES: https://www.snapeda.com/parts/ESP32-C6-WROOM-1-N8/Espressif+Systems/view-part/?ref=eda; DESCRIPTION: Multiprotocol Modules ESP32-C6 module, Wi-Fi 6 in 2.4 GHz band, Bluetooth 5, Zigbee 3.0 and Thread. ESP34-WROOM Compatible - ENGINEERING SAMPLE; MF: Espressif Systems; MP: ESP32-C6-WROOM-1-N8; PACKAGE: None; PRICE: None; SNAPEDA_LINK: https://www.snapeda.com/parts/ESP32-C6-WROOM-1-N8/Espressif+Systems/view-part/?ref=snap
U3 = DeskAssistant_v19_v1:DS3231SN#: Real Time Clock Serial 16-Pin SOIC W T/R Check availability <https://pricing.snapeda.com/parts/DS3231SN%23/Analog%20Devices/view-part?ref=eda>; AVAILABILITY: In Stock; CHECK_PRICES: https://www.snapeda.com/parts/DS3231SN%23/Analog+Devices/view-part/?ref=eda; DESCRIPTION: Extremely Accurate I²C-Integrated RTC/TCXO/Crystal; MF: Analog Devices; MP: DS3231SN#; PACKAGE: SOIC-16 Maxim; PRICE: None; PURCHASE-URL: https://www.snapeda.com/api/url_track_click_mouser/?unipart_id=99048&manufacturer=Analog Devices&part_name=DS3231SN#&search_term=None; SNAPEDA_LINK: https://www.snapeda.com/parts/DS3231SN%23/Analog+Devices/view-part/?ref=snap
U4 = DeskAssistant_v19_v1:MAX17048G+T10: Check availability <https://pricing.snapeda.com/parts/MAX17048G%2BT10/Analog%20Devices/view-part?ref=eda>; AVAILABILITY: In Stock; CHECK_PRICES: https://www.snapeda.com/parts/MAX17048G+T10/Analog+Devices/view-part/?ref=eda; DESCRIPTION: 3µA 1-Cell/2-Cell Fuel Gauge with ModelGauge; MF: Analog Devices; MP: MAX17048G+T10; PACKAGE: TDFN-8 Maxim; PRICE: None; PURCHASE-URL: https://www.snapeda.com/api/url_track_click_mouser/?unipart_id=329239&manufacturer=Analog Devices&part_name=MAX17048G+T10&search_term=None; SNAPEDA_LINK: https://www.snapeda.com/parts/MAX17048G+T10/Analog+Devices/view-part/?ref=snap

## Board
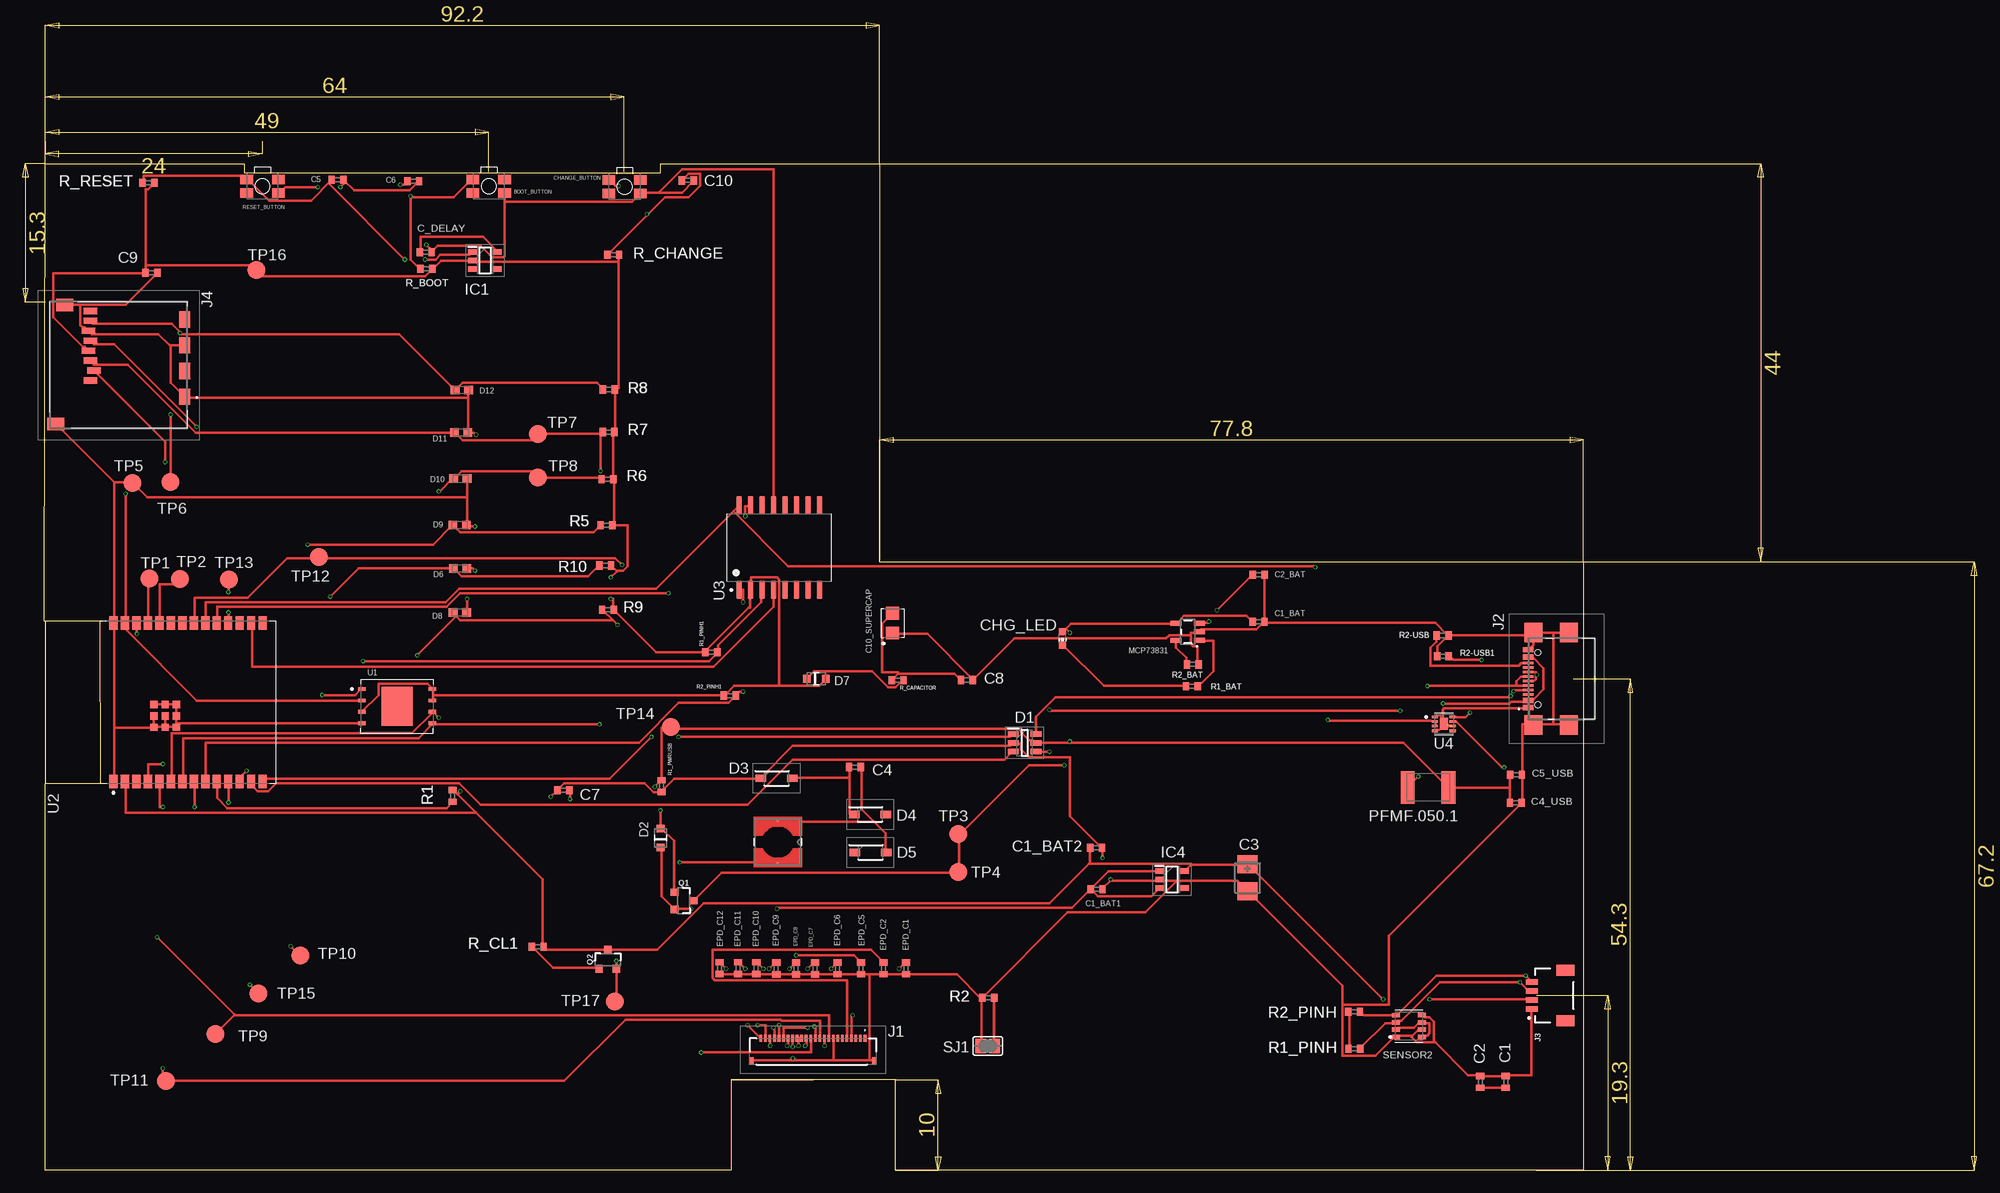
[diagram p1: board, top side]
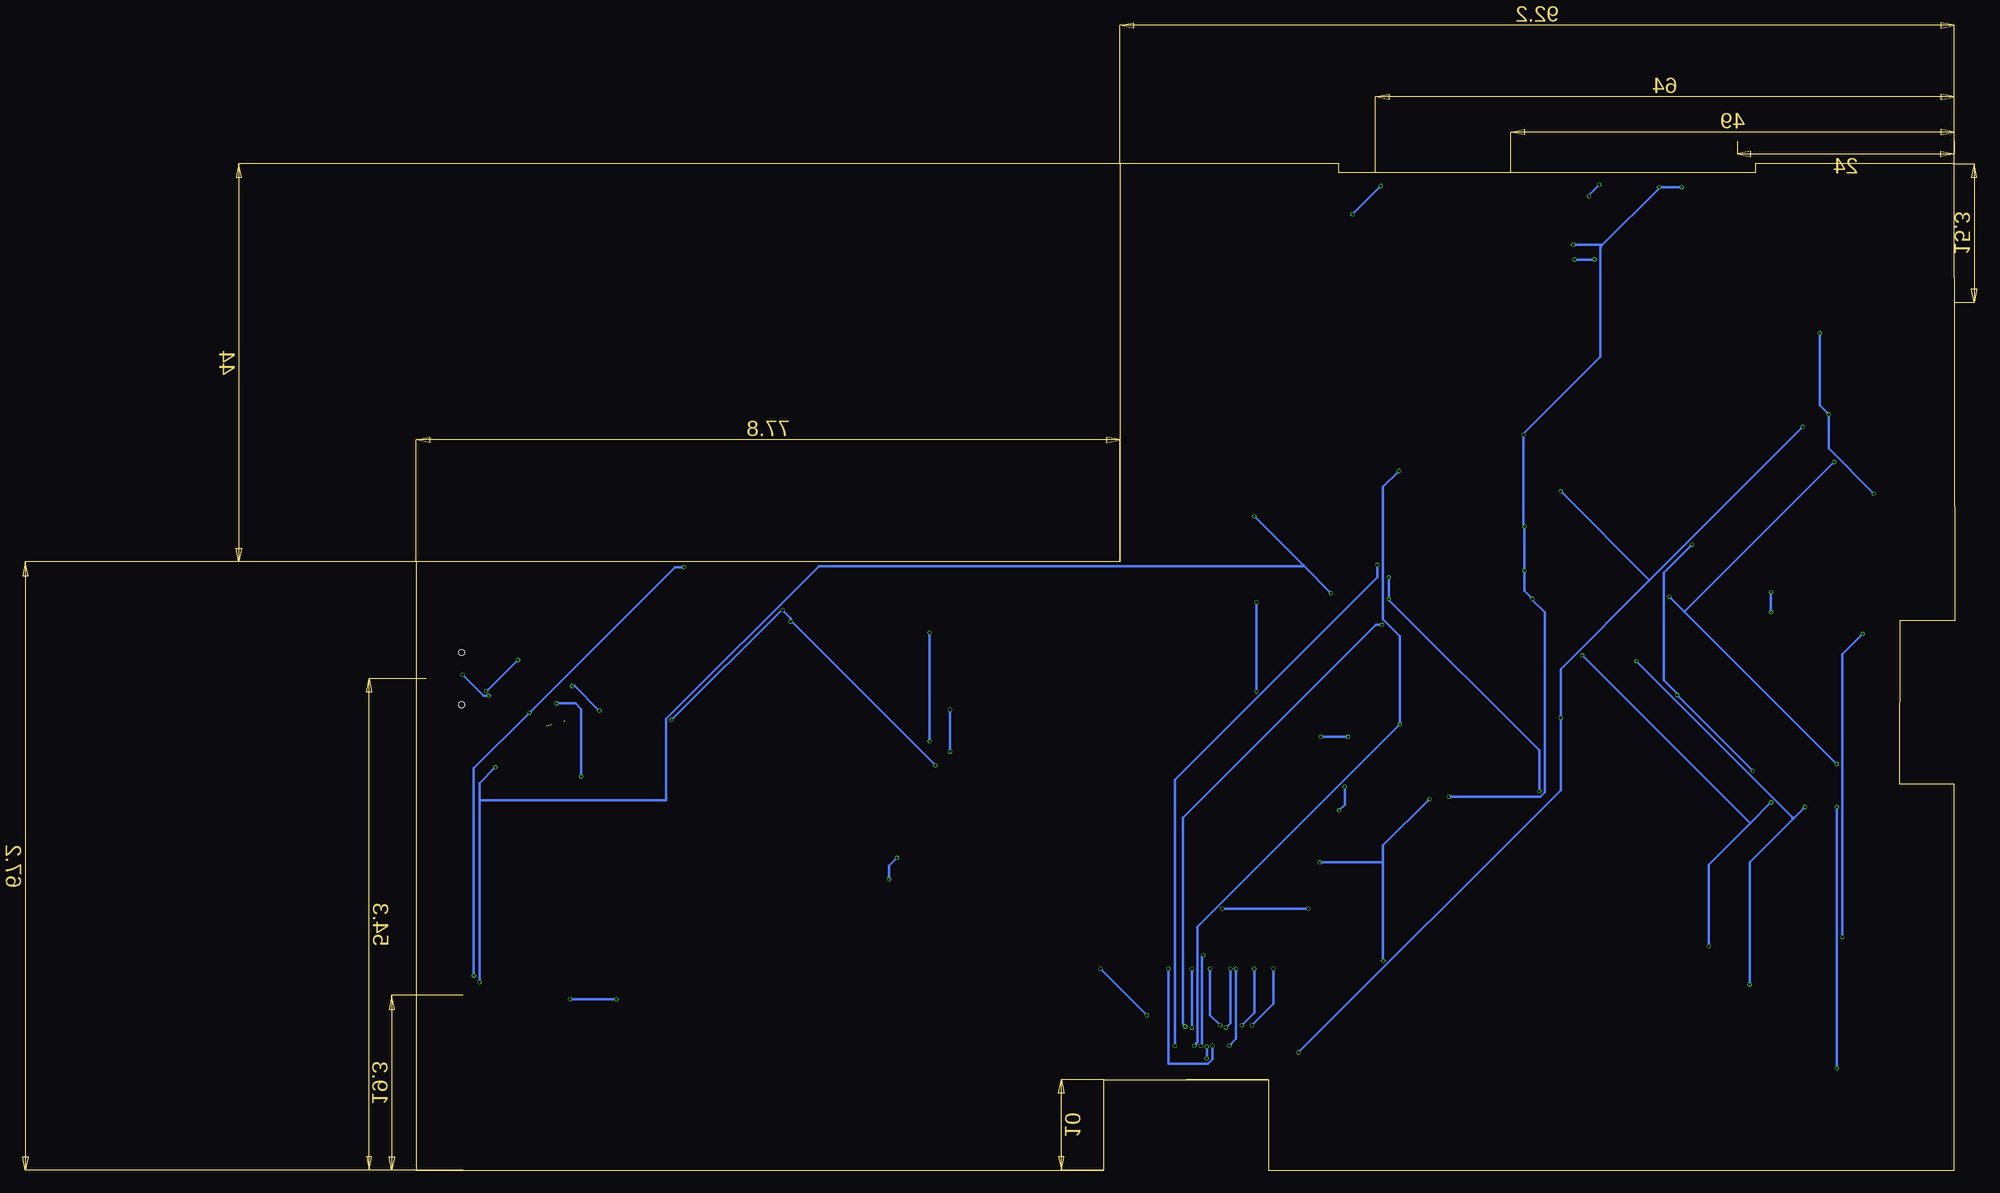
[diagram p2: board, bottom side, seen from below]

Size 170.1 x 111.2 mm. Coordinates in mm from the lower left corner, seen from the top.
Outline: 0.1,0 0.1,42.7 6.2,42.7 6.1,60.7 0,60.7 0.1,111.2 22.1,111.2 22.1,110.2 68.1,110.2 68.1,111.2 92.3,111.2 92.3,67.2 170.1,67.2 170.1,0 94.1,0 94.1,10 75.9,10 75.9,0 0.1,0
Copper layers (1*16): Top 0.035mm / dielectric 1.6mm / Bottom 0.035mm
Design rules "jlcpcb-2layers.dru": minimum track width 0.3mm, minimum drill 0.3mm, track to track 5mil, track to pad 5mil, pad to pad 5mil, via to via 5mil, smd to smd 5mil, copper to edge 0.2mm, drill to drill 6mil, minimum pad ring 10mil, minimum via ring 3mil, stop-mask expansion 4mil, vias tented up to drill 0mil, thermal gap 10mil

### Footprints (pad centres in the part's own frame; a part is rotated, then mirrored left to right if it is on the bottom)
MYBUTTON = smd 1.4 x 1.05: 1 1.75,0.75; 2 -1.75,0.75; 3 -1.75,-0.75; 4 1.75,-0.75
EAGLE-LTSPICE_C0402 = smd 0.7 x 0.9: 1 -0.65,0; 2 0.65,0
RCL_CT3528 = smd 2 x 2.2: + -1.5,0; - 1.5,0
CAPCP3225X100N = smd 1.4 x 1.4: 1 -1.1,0; 2 1.1,0
ADAFRUIT_CHIP-LED0603 = smd 0.8 x 0.8: A 0,-0.75; C 0,0.75
SOT95P280X145-6N = smd 1.2 x 0.6: 1 -1.25,0.95; 2 -1.25,0; 3 -1.25,-0.95; 4 1.25,-0.95; 5 1.25,0; 6 1.25,0.95
ESP32_WROVER_AVX---SD0805S020S1R0_AVX_SD0805S020S1R0_0 = smd 0.8 x 0.9: 1 -1.05,0; 2 1.05,0
SOD3716X135N = smd 1.15 x 0.8: 1 -1.75,0; 2 1.75,0
DIOC1608X36N = smd 0.97 x 0.94: 1 -0.75,0; 2 0.75,0
SOT95P280X125-5N = smd 0.9 x 0.6: 1 -1.4,0.95; 2 -1.4,0; 3 -1.4,-0.95; 4 1.4,-0.95; 5 1.4,0.95
SOT95P280X120-5N = smd 0.9 x 0.6: 1 -1.4,0.95; 2 -1.4,0; 3 -1.4,-0.95; 4 1.4,-0.95; 5 1.4,0.95
FH34SRJ24S05SH99 = smd 0.3 x 0.8: 1 5.75,1.45; 2 5.25,1.45; 3 4.75,1.45; 4 4.25,1.45; 5 3.75,1.45; 6 3.25,1.45; 7 2.75,1.45; 8 2.25,1.45; 9 1.75,1.45; 10 1.25,1.45; 11 0.75,1.45; 12 0.25,1.45; 13 -0.25,1.45; 14 -0.75,1.45; 15 -1.25,1.45; 16 -1.75,1.45; 17 -2.25,1.45; 18 -2.75,1.45; 19 -3.25,1.45; 20 -3.75,1.45; 21 -4.25,1.45; 22 -4.75,1.45; 23 -5.25,1.45; 24 -5.75,1.45 | smd 0.4 x 0.8: MP1 6.75,-1.05; MP2 -6.75,-1.05
SAMACSYS_PARTS_USB4110GFA = smd 0.3 x 1.15: A1 -3.35,3.678; A4 -2.55,3.678; A5 -1.25,3.678; A6 -0.25,3.678; A7 0.25,3.678; A8 1.25,3.678; A9 2.55,3.678; A12 3.35,3.678; B1 3.05,3.678; B4 2.25,3.678; B5 1.75,3.678; B6 0.75,3.678; B7 -0.75,3.678; B8 -1.75,3.678; B9 -2.25,3.678; B12 -3.05,3.678 | smd 2.18 x 2: MP1 -5.11,-0.827; MP2 5.11,-0.827; MP3 -5.11,3.103; MP4 5.11,3.103 | hole 0.65: -2.89,2.603; 2.89,2.603
JST04_1MM_RA = smd 0.6 x 1.35: 1 -1.5,0; 2 -0.5,0; 3 0.5,0; 4 1.5,0 | smd 1.2 x 2: NC1 2.8,-3.675; NC2 -2.8,-3.675
112ATAARR03ATTEND = smd 1.8 x 1.2: G1 10.6,10.4; G2 4.9,10.4; S1 7.75,10.4; S2 2.05,10.4 | smd 1.4 x 1.9: G3 13.6,-3.85; G4 0.45,-2.85 | smd 0.7 x 1.5: P1 8.8,0; P2 7.7,0.4; P3 6.6,0; P4 5.5,-0.2; P5 4.4,0; P6 3.3,-0.2; P7 2.2,0; P8 1.1,0
IND_4828-WE-TPC_WRE = smd 0.127 x 0.127: 1 -2.286,0; 2 2.286,0
ESP32_WROVER_SPARKFUN-IC-POWER_SOT23-5 = smd 0.55 x 1.2: 1 -0.95,-1.3; 2 0,-1.3; 3 0.95,-1.3; 4 0.95,1.3; 5 -0.95,1.3
ESP32C6_VARISTOR_CT/CN1812 = smd 1.5 x 3.6: 1 -2.25,0; 2 2.25,0
ESP32_WROVER_SPARKFUN-DISCRETESEMI_SOT23-3 = smd 0.8 x 0.9: 1 -0.95,-1; 2 0.95,-1; 3 0,1.1
ESP32_WROVER_EAGLE-LTSPICE_R0402 = smd 0.7 x 0.9: 1 -0.65,0; 2 0.65,0
ESP32_WROVER_BME680_PSON80P300X300X100-8N = smd 1.016 x 0.5: 1 1.458,1.2; 2 1.458,0.4; 3 1.458,-0.4; 4 1.458,-1.2; 5 -1.458,-1.22; 6 -1.458,-0.4; 7 -1.458,0.4; 8 -1.458,1.2
SJ = smd 1.168 x 1.6: 1 -0.762,0; 2 0.762,0
TP20R = smd 2 x 2: TP 0,0
SON127P600X800X80-9N = smd 0.94 x 0.44: 1 -3.895,1.905; 2 -3.895,0.635; 3 -3.895,-0.635; 4 -3.895,-1.905; 5 3.895,-1.905; 6 3.895,-0.635; 7 3.895,0.635; 8 3.895,1.905 | smd 3.4 x 4.3: 9 0,0
XCVR_ESP32-C6-WROOM-1-N8 = smd 1.5 x 0.9: 1 -8.75,5.26; 2 -8.75,3.99; 3 -8.75,2.72; 4 -8.75,1.45; 5 -8.75,0.18; 6 -8.75,-1.09; 7 -8.75,-2.36; 8 -8.75,-3.63; 9 -8.75,-4.9; 10 -8.75,-6.17; 11 -8.75,-7.44; 12 -8.75,-8.71; 13 -8.75,-9.98; 14 -8.75,-11.25; 15 8.75,-11.25; 16 8.75,-9.98; 17 8.75,-8.71; 18 8.75,-7.44; 19 8.75,-6.17; 20 8.75,-4.9; 21 8.75,-3.63; 22 8.75,-2.36; 23 8.75,-1.09; 24 8.75,0.18; 25 8.75,1.45; 26 8.75,2.72; 27 8.75,3.99; 28 8.75,5.26 | smd 0.8 x 0.8: 29_1 -2.755,0.79; 29_2 -1.505,0.79; 29_3 -0.255,0.79; 29_4 -2.755,-0.46; 29_5 -1.505,-0.46; 29_6 -0.255,-0.46; 29_7 -2.755,-1.71; 29_8 -1.505,-1.71; 29_9 -0.255,-1.71
SOIC127P1032X265-16N = smd 2.05 x 0.59: 1 -4.655,4.445; 2 -4.655,3.175; 3 -4.655,1.905; 4 -4.655,0.635; 5 -4.655,-0.635; 6 -4.655,-1.905; 7 -4.655,-3.175; 8 -4.655,-4.445; 9 4.655,-4.445; 10 4.655,-3.175; 11 4.655,-1.905; 12 4.655,-0.635; 13 4.655,0.635; 14 4.655,1.905; 15 4.655,3.175; 16 4.655,4.445
SON50P200X200X80-9N = smd 0.76 x 0.27: 1 -0.985,0.75; 2 -0.985,0.25; 3 -0.985,-0.25; 4 -0.985,-0.75; 5 0.985,-0.75; 6 0.985,-0.25; 7 0.985,0.25; 8 0.985,0.75 | smd 0.9 x 1.3: 9 0,0

### Placement (x,y rotation side)
BOOT_BUTTON  49.13,108.72 180 top
C1  161.52,9.76 90 top
C1_BAT  134.21,60.58 0 top
C1_BAT1  116.31,31.02 0 top
C1_BAT2  116.25,35.62 0 top
C2  158.7,9.76 90 top
C2_BAT  134.22,65.78 0 top
C3  132.99,32.3 270 top
C4  89.6,44.54 0 top
C4_USB  162.64,40.6 0 top
C5  32.41,109.44 0 top
C5_USB  162.65,43.7 0 top
C6  40.78,109.26 0 top
C7  57.37,41.96 180 top
C8  101.96,54.16 0 top
C9  11.84,99.16 0 top
C10  71.12,109.36 0 top
C10_SUPERCAP  93.75,60.44 90 top
C_DELAY  42.15,101.42 0 top
CHANGE_BUTTON  64.14,108.66 180 top
CHG_LED  112.54,58.75 180 top
D1  108.34,47.22 0 top
D2  68.12,36.7 90 top
D3  80.93,43.3 0 top
D4  91.27,39.3 0 top
D5  91.31,35.1 0 top
D6  45.95,66.5 0 top
D7  85.32,54.31 0 top
D8  45.93,61.6 0 top
D9  45.91,71.3 0 top
D10  45.99,76.4 0 top
D11  46.07,81.5 0 top
D12  46.15,86.2 0 top
EPD_C1  95.26,22.3 90 top
EPD_C2  92.77,22.3 90 top
EPD_C5  90.28,22.3 90 top
EPD_C6  87.69,22.3 90 top
EPD_C7  85.18,22.28 90 top
EPD_C8  83.09,22.28 90 top
EPD_C9  80.9,22.28 90 top
EPD_C10  78.69,22.32 90 top
EPD_C11  76.67,22.32 90 top
EPD_C12  74.63,22.32 90 top
IC1  48.71,100.52 0 top
IC4  124.65,32.12 0 top
J1  84.95,13.12 0 top
J2  167.67,54.3 90 top
J3  164.42,19.3 90 top
J4  5.1,96.05 270 top
L1  81.07,36.25 270 top
MCP73831  126.39,59.49 90 top
PFMF.050.1  152.94,42.3 0 top
Q1  70.66,29.76 270 top
Q2  62.28,23.26 0 top
R1  45.11,41.36 90 top
R1_BAT  126.83,53.48 0 top
R1_PINH  144.79,13.42 180 top
R1_PINH1  73.72,57.24 180 top
R1_PWRUSB  68.21,42.44 90 top
R2  104.33,19.04 0 top
R2-USB  154.55,59.08 0 top
R2-USB1  154.58,56.8 0 top
R2_BAT  126.94,55.88 0 top
R2_PINH  144.76,17.5 180 top
R2_PINH1  75.76,52.44 180 top
R5  62.13,71.26 0 top
R6  62.25,76.36 0 top
R7  62.37,81.56 0 top
R8  62.39,86.26 0 top
R9  62.29,61.94 0 top
R10  61.99,66.81 0 top
R_BOOT  42.23,99.6 0 top
R_CAPACITOR  94.31,54.14 0 top
R_CHANGE  62.88,101.14 0 top
R_CL1  54.53,24.68 0 top
R_RESET  11.51,109.12 0 top
RESET_BUTTON  24.12,108.72 180 top
SENSOR2  150.82,15.92 180 top
SJ1  104.28,13.72 0 top
TP1  11.61,65.4 0 top
TP2  14.97,65.34 0 top
TP3  100.99,37.14 0 top
TP4  100.99,32.92 0 top
TP5  9.76,75.92 0 top
TP6  13.93,76.02 0 top
TP7  54.55,81.32 0 top
TP8  54.57,76.52 0 top
TP9  18.89,15.02 0 top
TP10  28.28,23.74 0 top
TP11  13.43,9.84 0 top
TP12  30.33,67.74 0 top
TP13  20.38,65.24 0 top
TP14  69.23,48.94 0 top
TP15  23.68,19.54 0 top
TP16  23.43,99.44 0 top
TP17  63.08,18.64 0 top
U1  38.99,51.26 0 top
U2  12.9,51.7 90 top
U3  81.25,68.8 90 top
U4  154.68,49.32 0 top

### Tracks (layer width: path | path; a pad name or v marks a point on that pad's centre or on a via)
3V3  (via drill 0.3)
  Top 0.3: U1.3 36.98,52.5 36.98,53.75 42.35,53.75 42.85,53.25 U1.8 42.98,53.12 42.98,52.5 | 42.98,52.5 42.98,52 U1.7 | 81.22,53.5 85.6,53.5 86.35,54.25 D7.2 | 81.22,53.5 76.22,53.5 75.22,52.5 R2_PINH1.2 74.97,52.5 42.98,52.5 | 81.22,53.5 81.22,65.25 80.97,65.5 78.1,65.5 78.1,64.25 U3.2 77.97,64.12 77.97,62.12 77.85,62.12 73.1,57.38 R1_PINH1.2 72.97,57.25 67.6,57.25 62.98,61.88 R9.2 62.85,62 62.85,63.12 v62.6,63.12 | 11.22,100 11.22,108.38 11.47,108.38 12.1,109 R_RESET.2 | 11.22,100 11.22,99.25 C9.1 11.1,99.12 0.97,99.12 0.97,94.25 4.22,91 4.47,91 4.85,90.62 J4.P4 | 11.22,100 22.85,100 23.35,99.5 TP16.TP 23.48,99.38 24.1,98.75 42.1,98.75 42.85,99.5 R_BOOT.2 42.98,99.62 43.85,100.5 47.23,100.5 IC1.2 47.35,100.5 47.48,100.38 63.48,100.38 | 63.23,66.25 62.73,66.75 R10.2 | 63.23,66.25 63.98,66.25 64.47,66.75 64.47,71.25 62.85,71.25 R5.2 62.98,71.38 62.98,76.25 R6.2 62.85,76.5 62.85,81.5 62.98,81.5 R7.2 63.1,81.62 63.1,86.25 R8.2 63.1,86.38 63.48,86.38 63.48,100.38 | 63.48,100.38 63.48,101.12 R_CHANGE.2 | v62.6,65.5 63.23,66.12 63.23,66.25 | 126.72,33.75 126.1,33.12 IC4.5 | 126.72,33.75 132.97,33.75 C3.+ 133.1,33.75 v147.97,18.88 | 115.6,33.88 C1_BAT2.1 | 115.6,33.88 126.72,33.88 126.72,33.75 | v153.1,18.88 164.35,18.88 J3.2 | 47.66,39.56 55.1,32.12 55.1,24.75 R_CL1.2 55.23,24.62 55.48,24.38 62.23,24.38 Q2.3 62.35,24.38 67.72,24.38 72.85,29.5 111.1,29.5 115.47,33.88 115.6,33.88 | 47.66,39.56 45.66,41.56 | 45.66,41.56 45.23,42 R1.2 | U2.2 8.97,42.88 8.97,39.5 47.6,39.5 47.66,39.56 | 45.66,41.56 v45.98,41.88
  Bottom 0.3: v62.6,65.5 v62.6,63.12 62.6,63 45.98,46.38 v45.98,41.88 | v147.97,18.88 v153.1,18.88
32KHZ  (via drill 0.3)
  Top 0.3: v77.22,52.88 76.85,52.88 76.47,52.5 R2_PINH1.1 76.35,52.38 75.6,51.62 70.1,51.62 65.72,47.25 17.85,47.25 17.85,43 U2.9 | v77.22,62.75 77.22,64.12 76.85,64.12 U3.1
  Bottom 0.3: v77.22,62.75 v77.22,52.88
DN  (via drill 0.3)
  Top 0.3: v152.85,53.5 162.72,53.5 | 162.72,53.5 163.97,53.5 J2.B7 | v111.1,50.88 111.22,50.75 149.86,50.75 v149.86,50.77 | v111.1,46.25 109.6,46.25 D1.4 | 162.72,53.5 162.72,54 163.22,54.5 163.97,54.5 J2.A7
  Bottom 0.3: v111.1,46.25 v111.1,50.88 | v152.85,53.5 152.59,53.5 v149.86,50.77
DP  (via drill 0.3)
  Top 0.3: 164.85,54.75 164.85,55 164.1,55 J2.B6 | 164.85,54.75 164.85,54.25 164.6,54 164.1,54 J2.A6 | D1.6 109.6,48.25 109.6,50.09 111.78,52.27 161.94,52.27 v162.07,52.41 | 164.85,54.75 v164.97,54.75
  Bottom 0.3: v164.97,54.75 162.63,52.41 v162.07,52.41
EPD_3V3  (via drill 0.3)
  Top 0.3: TP17.TP 63.1,18.75 63.23,18.75 Q2.2 63.23,22.38 v63.23,23.12 | v58.1,41 58.1,41.88 C7.1 | v70.22,34 81.05,34 L1.2
  Bottom 0.3: v58.1,41 63.23,35.88 63.23,34 | v63.23,23.12 63.23,34 | 63.23,34 v70.22,34
EPD_3V3_C  (via drill 0.3)
  Top 0.3: v20.35,61.62 20.35,60.5 U2.18 | v20.35,63.88 20.35,65.12 TP13.TP
  Bottom 0.3: v20.35,63.88 v20.35,61.62
EPD_BUSY  (via drill 0.3)
  Top 0.3: 20.98,17.12 86.72,17.12 86.72,14.62 J1.9 | 20.98,17.12 18.98,15.12 TP9.TP | v10.22,59.25 10.22,60.38 U2.26 | v12.47,25.75 20.98,17.25 20.98,17.12
  Bottom 0.3: v10.22,59.25 12.47,57 v12.47,25.75
EPD_CS  (via drill 0.3)
  Top 0.3: v20.35,40.62 20.35,42.88 U2.11 | v27.23,24.75 28.23,23.75 TP10.TP | v85.1,15.88 85.22,15.88 85.22,14.62 J1.12 | 62.79,60.81 61.73,61.88 R9.1 | 62.79,60.81 v63.35,60.25 | 45.54,61.19 45.98,60.75 62.73,60.75 62.79,60.81 | 45.54,61.19 45.23,61.5 D8.1 | 45.54,61.19 v41.23,56.88
  Bottom 0.3: 22.66,38.31 27.23,33.75 v27.23,24.75 | 22.66,38.31 v20.35,40.62 | v85.1,15.88 85.38,16.15 85.38,38.92 64.05,60.25 v63.35,60.25 | v41.23,56.88 22.66,38.31
EPD_DC  (via drill 0.3)
  Top 0.3: J1.11 85.72,14.62 85.72,16.5 81.47,16.5 81.35,16.62 64.22,16.62 57.48,9.88 13.47,9.88 TP11.TP 13.47,10 13.1,10 v13.1,11.25 | v13.1,40.12 12.72,40.12 12.72,42.88 U2.5
  Bottom 0.3: v13.1,11.25 v13.1,40.12
EPD_RST  (via drill 0.3)
  Top 0.3: v86.22,13.75 86.22,14.5 J1.10 | v63.85,66.88 63.1,67.62 30.35,67.62 TP12.TP 30.23,67.62 26.85,67.62 22.48,63.25 16.6,63.25 16.6,60.5 U2.21
  Bottom 0.3: v86.22,13.75 86.22,43.12 63.85,65.5 v63.85,66.88
FLASH_CS  (via drill 0.3)
  Top 0.3: R5.1 60.73,70.5 45.98,70.5 45.23,71.25 D9.1 45.1,71.25 42.98,69.12 v29.1,69.12 | v30.73,52.5 34.35,52.5 34.98,53.12 U1.1 | v22.35,44.12 21.73,43.5 21.73,43 U2.12
  Bottom 0.3: v22.35,44.12 v30.73,52.5 30.73,52.62 32.23,54.12 32.23,66 v29.1,69.12
GND  (via drill 0.3)  (1 unrouted)
  Top 0.3: 50.85,107 50.85,107.88 BOOT_BUTTON.2 | 50.85,107 50.85,101 50.73,100.88 49.48,100.88 48.23,102.12 43.48,102.12 42.85,101.5 C_DELAY.2 42.85,101.62 v42.23,102.25 | 67.97,108 65.97,108 CHANGE_BUTTON.2 65.85,107.88 64.97,107 50.85,107 | 67.97,108 70.47,108 71.72,109.25 C10.2 | U3.13 80.6,73.5 80.6,110.62 70.47,110.62 67.97,108.12 67.97,108 | 7.72,76 1.35,82.38 J4.G3 | 7.72,76 9.72,76 TP5.TP 9.85,75.88 11.35,74.38 46.73,74.38 | U2.29_3 12.22,51.5 13.35,51.5 U2.29_6 13.47,51.5 14.6,51.5 U2.29_9 14.6,51.38 14.6,50.25 U2.29_8 14.6,50.12 14.6,49.38 | U2.29_1 12.1,49 12.1,50.12 U2.29_2 | U2.29_4 13.35,49 12.22,49 U2.29_1 | U2.29_4 13.47,49 14.6,49 U2.29_7 14.6,49.12 14.6,49.38 | U2.29_5 13.35,50.12 13.35,49.12 U2.29_4 | 14.6,49.38 34.98,49.38 U1.4 | 7.72,48.88 7.72,43 U2.1 | 7.72,48.88 11.97,48.88 U2.29_1 | 7.72,48.88 7.72,60.38 U2.28 7.72,60.5 7.72,76 | 3.98,95.62 2.35,95.62 J4.G4 | 3.98,95.62 8.97,95.62 12.47,99.12 C9.2 | 3.98,95.62 3.98,93.38 4.22,93.12 4.47,93.12 4.85,92.75 J4.P6 4.97,92.62 5.22,92.38 12.6,92.38 13.85,91.12 13.97,91.12 | C6.2 41.35,109.25 40.35,108.25 34.23,108.25 33.1,109.38 C5.2 33.23,109.12 v32.73,108.62 | v30.23,108.62 26.6,108.62 25.98,108 RESET_BUTTON.2 | 46.73,74.38 46.73,76.38 D10.2 | 46.73,74.38 46.73,71.38 D9.2 46.85,71.38 47.1,71.12 v47.6,71.12 | v46.73,63.12 46.73,61.62 D8.2 | v47.6,66.25 47.35,66.5 D6.2 | 46.85,85.38 46.85,86.12 D12.2 | 46.85,85.38 46.85,81.5 D11.2 47.48,81.5 v47.73,81.25 | 13.97,91.12 13.97,87 15.47,85.5 J4.G1 15.6,85.38 46.85,85.38 | 13.97,91.12 15.47,91.12 J4.G2 | R2-USB1.1 153.97,56.88 153.97,57.88 155.1,59 R2-USB.2 | J2.B1 163.97,57.38 163.97,57.62 J2.A12 164.19,57.65 164.57,58.02 J2.MP4
  Top 0.3: R2-USB.2 155.35,59.12 163.97,59.12 J2.MP4 | 166.8,59.38 164.6,59.38 J2.MP4 | 166.8,59.38 168.47,59.38 J2.MP2 | 154.82,49.65 154.22,50.25 153.97,50.25 U4.1 | 154.82,49.65 U4.9 154.58,49.42 154.58,50.92 154.72,51.06 163.89,51.06 J2.A1 | J2.A1 163.97,51 163.97,51.25 J2.B12 | J2.A1 164.1,50.88 164.1,49.25 164.47,49.25 J2.MP3 | J2.MP3 163.97,49.25 163.35,49.25 163.35,43.75 C5_USB.2 163.35,43.62 163.35,40.62 C4_USB.2 163.22,40.5 148.6,25.88 148.6,18.25 143.47,18.25 | 166.8,49.25 164.6,49.25 J2.MP3 | 166.8,49.25 168.47,49.25 J2.MP1 | 166.8,49.25 166.8,59.38 | C10_SUPERCAP.1 93.85,59.25 97.6,59.25 102.6,54.25 C8.2 102.72,54.25 107.22,58.75 123.97,58.75 124.35,59.12 126.72,59.12 | 126.72,59.12 126.72,59.38 127.6,59.38 MCP73831.2 127.72,59.62 127.85,59.75 133.97,59.75 134.72,60.5 C1_BAT.2 | 126.72,59.12 126.72,58.12 126.97,57.88 127.47,57.88 127.47,56 R2_BAT.2 | C1_BAT.2 134.85,60.62 134.85,65.75 C2_BAT.2 | R2-USB.2 155.1,59.12 153.72,60.5 134.97,60.5 C1_BAT.2 | 91.22,12.12 91.6,12.12 J1.MP1 | 91.22,12.12 87.22,12.12 | 87.22,12.12 82.72,12.12 | 82.72,12.12 78.22,12.12 J1.MP2 | v82.72,13.62 82.72,14.5 J1.17 | v82.72,12.38 82.72,12.12 | 87.22,12.12 87.22,14.5 J1.8 | R2.1 103.6,19 103.6,13.75 SJ1.1 | 91.22,21.62 92.72,21.62 EPD_C2.1 92.85,21.62 95.22,21.62 EPD_C1.1 95.35,21.62 100.85,21.62 103.47,19 R2.1 | 91.22,21.62 90.35,21.62 EPD_C5.1 90.22,21.62 87.72,21.62 EPD_C6.1 87.6,21.62 85.22,21.62 EPD_C7.1 85.1,21.62 83.22,21.62 EPD_C8.1 82.97,21.62 80.97,21.62 EPD_C9.1 80.85,21.62 78.72,21.62 EPD_C10.1 78.6,21.62 76.72,21.62 EPD_C11.1 76.6,21.62 74.72,21.62 EPD_C12.1
  Top 0.3: 91.22,21.62 91.22,12.12 | 117.85,32 116.97,31.12 C1_BAT1.2 | 117.85,32 123.22,32 IC4.2 123.35,32 125.1,32 | 125.1,32 131.85,32 132.97,30.88 C3.- 133.1,30.75 143.47,20.38 143.47,18.25 | 151.1,14.88 151.22,14.88 151.85,15.5 152.22,15.5 SENSOR2.7 | 151.1,14.88 149.6,14.88 149.47,14.75 SENSOR2.1 149.22,14.75 147.1,12.62 143.47,12.62 143.47,18.25 | 153.6,14.12 153.6,16.38 153.1,16.88 152.6,16.88 152.35,17.12 SENSOR2.5 | 153.6,14.12 151.72,14.12 151.1,14.75 151.1,14.88 | J3.1 164.35,17.75 164.35,10.5 161.6,10.5 C1.2 161.47,10.38 158.72,10.38 C2.2 158.6,10.5 157.35,10.5 153.72,14.12 153.6,14.12 | R2.1 103.72,19.12 113.1,28.5 121.72,28.5 125.1,31.88 125.1,32 | v116.97,34.5 116.97,35.5 C1_BAT2.2 116.85,35.62 113.35,39.12 113.35,45.62 108.85,45.62 107.97,46.5 107.97,47.12 107.1,47.12 D1.2 106.97,47.12 106.72,46.88 82.72,46.88 79.22,43.38 D3.1 79.1,43.25 69.6,43.25 68.22,41.88 R1_PWRUSB.1 68.1,41.75 67.35,41.75 66.35,42.75 57.48,42.75 56.73,42 C7.2 56.6,41.88 v55.98,41.25 | v117.85,32.12 117.85,32 | 155.11,49.24 155.01,49.34 155.01,49.47 154.82,49.65 | U4.4 153.8,48.64 153.83,48.66 154.17,48.66 154.58,49.07 U4.6
  Bottom 0.3: v30.23,108.62 v32.73,108.62 32.73,108.5 39.04,102.19 | 39.04,102.19 39.23,102 39.23,89.88 47.73,81.38 v47.73,81.25 47.73,71.38 47.6,71.25 v47.6,71.12 v47.6,66.25 47.6,64 v46.73,63.12 46.73,63 45.35,61.62 45.35,41.75 45.85,41.25 v55.98,41.25 | v42.23,102.25 39.1,102.25 39.04,102.19 | v82.72,12.38 v82.72,13.62 | v116.97,34.5 117.85,33.62 v117.85,32.12
GPIO8
  Top 0.3: R1.1 45.1,40.62 44.48,40 20.23,40 19.1,41.12 19.1,42.88 U2.10
INT_RTC  (via drill 0.3)
  Top 0.3: U3.3 79.22,64.12 79.22,62.75 74.47,58 74.47,57.25 R1_PINH1.1 74.35,57.12 73.47,56.25 v35.23,56.25 | v16.6,40.12 16.6,42.88 U2.8 | v22.73,20.5 23.6,19.62 TP15.TP
  Bottom 0.3: 17.91,38.81 22.73,34 v22.73,20.5 | 17.91,38.81 v16.6,40.12 | v35.23,56.25 17.98,39 17.98,38.88 17.91,38.81
MISO  (via drill 0.3)
  Top 0.3: U1.2 34.98,51.88 16.85,51.88 8.97,59.75 8.97,60.38 U2.27 8.97,60.5 v8.97,74.75 | R8.1 61.73,86.38 61.1,87 46.23,87 45.48,86.25 D12.1 39.23,92.38 15.22,92.38 15.04,92.56 | 15.04,92.56 14.1,93.5 5.35,93.5 5.1,93.75 J4.P7 | v13.97,83.5 13.97,76.12 TP6.TP | v14.97,92.5 15.04,92.56
  Bottom 0.3: v14.97,92.5 14.97,84.5 v13.97,83.5 13.97,79.75 v8.97,74.75
MOSI  (via drill 0.3)
  Top 0.3: J4.P3 5.1,89.38 5.47,89 9.22,89 16.73,81.5 D11.1 45.35,81.5 46.23,80.62 53.85,80.62 54.48,81.25 TP7.TP 54.6,81.38 61.48,81.38 61.6,81.5 R7.1 61.48,81.25 v61.48,77.25 | v84.1,13.75 84.22,13.75 84.22,14.5 J1.14 | v61.35,49.25 42.98,49.25 U1.5 42.85,49.25 41.35,47.75 15.35,47.75 15.35,43 U2.7
  Bottom 0.3: v84.1,13.75 83.72,14.12 83.72,26.88 v61.35,49.25 61.35,59 63.23,60.88 63.23,75.5 v61.48,77.25
N$1  (via drill 0.3)
  Top 0.3: v158.85,56.38 155.72,56.38 155.35,56.75 R2-USB1.2 | J2.A5 163.97,53 162.47,53 v162.38,52.91
  Bottom 0.3: v162.38,52.91 162.31,52.91 v158.85,56.38
N$2
  Top 0.3: R2-USB.1 153.85,59 153.85,58.38 153.22,57.75 153.22,55.75 162.97,55.75 163.22,56 163.97,56 J2.B5
N$20  (via drill 0.3)
  Top 0.3: D2.1 68.22,35.62 68.22,30.25 69.6,28.88 Q1.2 69.72,28.88 v71.47,28.88 | C1_BAT1.1 115.72,31.12 117.6,33 123.22,33 IC4.1 | IC4.3 123.22,31.12 122.35,30.25 116.47,30.25 115.72,31 C1_BAT1.1 | v80.97,28.88 81.1,29 113.6,29 115.6,31 C1_BAT1.1
  Bottom 0.3: v80.97,28.88 v71.47,28.88
N$25
  Top 0.3: 88.97,43.38 88.97,39.38 89.47,39.38 D4.1 | 88.97,43.38 88.97,44.5 C4.1 | 88.97,43.38 82.72,43.38 D3.2
N$30
  Top 0.3: R1_BAT.2 127.6,53.5 129.22,55.12 129.22,58.5 127.72,58.5 MCP73831.1
N$31
  Top 0.3: CHG_LED.C 112.6,58 117.1,53.5 126.1,53.5 R1_BAT.1
N$32
  Top 0.3: R2_BAT.1 126.22,56 126.22,56.62 125.1,57.75 125.1,58.5 MCP73831.5
N$60  (via drill 0.3)
  Top 0.3: v77.72,16 79.1,14.62 J1.24 | EPD_C12.2 v75.35,22.25
  Bottom 0.3: v77.72,16 75.35,18.38 v75.35,22.25
N$61  (via drill 0.3)
  Top 0.3: v78.85,16 79.72,16 79.72,14.62 J1.23 | v77.47,22.25 76.85,22.88 76.72,22.88 EPD_C11.2
  Bottom 0.3: v78.85,16 77.47,17.38 v77.47,22.25
N$62  (via drill 0.3)
  Top 0.3: v80.22,13.75 80.22,14.5 J1.22 | v79.47,22.25 78.85,22.88 78.72,22.88 EPD_C10.2
  Bottom 0.3: v80.22,13.75 79.47,14.5 v79.47,22.25
N$63  (via drill 0.3)
  Top 0.3: v80.6,15.75 80.72,15.75 80.72,14.62 J1.21 | v80.1,22.25 80.72,22.88 80.85,22.88 EPD_C9.2
  Bottom 0.3: v80.6,15.75 80.1,16.25 v80.1,22.25
N$64  (via drill 0.3)
  Top 0.3: v81.22,16 81.22,14.62 J1.20 | v82.35,22.25 82.97,22.88 EPD_C8.2
  Bottom 0.3: v81.22,16 82.35,17.12 v82.35,22.25
N$65  (via drill 0.3)
  Top 0.3: v84.35,15.75 81.72,15.75 81.72,14.62 J1.19 | v84.35,22.25 84.97,22.88 85.1,22.88 EPD_C7.2
  Bottom 0.3: v84.35,22.25 v84.35,15.75
N$66  (via drill 0.3)
  Top 0.3: v82.1,13.75 82.22,13.88 82.22,14.5 J1.18 | v86.97,22.25 87.6,22.88 EPD_C6.2
  Bottom 0.3: v82.1,13.75 82.1,12.25 82.6,11.75 86.97,11.75 v86.97,22.25
N$67  (via drill 0.3)
  Top 0.3: 83.35,14.62 83.6,14.62 J1.15 | 83.35,14.62 83.22,14.62 J1.16 | v83.1,23.75 89.47,23.75 90.22,23 EPD_C5.2 | 83.35,14.62 v83.35,13.75
  Bottom 0.3: v83.1,23.75 83.22,23.62 83.22,13.88 v83.35,13.75
N$74
  Top 0.3: J1.5 88.72,14.62 88.72,21 74.1,21 73.85,21.25 73.85,24.38 91.35,24.38 92.72,23 EPD_C2.2
N$75  (via drill 0.3)
  Top 0.3: v89.35,17.12 89.22,17.12 89.22,14.62 J1.4 | v94.47,22.25 95.1,22.88 95.22,22.88 EPD_C1.2
  Bottom 0.3: v94.47,22.25 v89.35,17.12
N$78
  Top 0.3: R_CL1.1 53.98,24.62 56.23,22.38 61.23,22.38 Q2.1
N$82
  Top 0.3: R1_PINH.2 144.22,13.5 144.22,17.5 R2_PINH.2
N$83
  Top 0.3: SENSOR2.8 152.35,14.75 152.47,14.88 152.85,14.88 153.1,15.12 153.1,16.25 152.35,16.25 SENSOR2.6 152.22,16.25 151.85,16.25 151.35,15.75 149.6,15.75 149.47,15.62 SENSOR2.2
N$86
  Top 0.3: C2.1 158.72,9.12 161.47,9.12 C1.1
N$87  (via drill 0.3)
  Top 0.3: R_RESET.1 10.97,109.12 10.97,109.88 21.85,109.88 22.23,109.5 22.35,109.5 RESET_BUTTON.4 22.48,109.38 22.6,109.38 24.85,107.12 29.48,107.12 31.73,109.38 C5.1 31.48,109 v39.85,100.62 | v42.1,100.62 43.23,100.62 43.73,101.12 46.98,101.12 47.23,101.38 IC1.1
  Bottom 0.3: v39.85,100.62 v42.1,100.62
N$88  (via drill 0.3)
  Top 0.3: 40.48,107.5 40.48,100.62 41.48,99.62 R_BOOT.1 | 40.48,107.5 45.23,107.5 47.1,109.38 47.35,109.38 BOOT_BUTTON.4 | v39.35,108.88 39.73,108.88 40.1,109.25 C6.1 | v40.48,107.62 40.48,107.5
  Bottom 0.3: v39.35,108.88 40.48,107.75 v40.48,107.62
N$89  (via drill 0.3)
  Top 0.3: 66.66,105.56 68.6,107.5 71.22,107.5 72.47,108.75 72.47,110.12 71.22,110.12 70.47,109.38 C10.1 | 66.66,105.56 62.35,101.25 R_CHANGE.1 | v63.48,108.75 63.1,108.75 62.48,109.38 CHANGE_BUTTON.4 | v66.6,105.62 66.66,105.56
  Bottom 0.3: v66.6,105.62 v63.48,108.75
N$90
  Top 0.3: C_DELAY.1 41.6,101.5 41.6,103.12 48.48,103.12 50.1,101.5 IC1.5
N$100
  Top 0.3: D7.1 84.35,54.38 85.1,55.12 91.47,55.12 93.22,53.38 94.1,53.38 94.85,54.12 R_CAPACITOR.2
N$101
  Top 0.3: 94.35,54.88 93.72,54.25 R_CAPACITOR.1 | 94.35,54.88 100.6,54.88 101.22,54.25 C8.1 | C10_SUPERCAP.2 93.72,61.5 92.6,60.38 92.6,55 94.35,55 94.35,54.88
RESE'
  Top 0.3: R2.2 104.97,19 104.97,13.75 SJ1.2
RTC_RST
  Top 0.3: U2.16 22.98,60.38 22.98,55.62 73.97,55.62 80.6,62.25 80.6,64.12 U3.4
RX
  Top 0.3: U2.24 12.72,60.5 12.72,64.75 14.35,64.75 14.85,65.25 TP2.TP
SCK  (via drill 0.3)
  Top 0.3: R6.1 61.6,76.38 61.48,76.5 54.6,76.5 TP8.TP 54.48,76.62 53.85,77.25 46.1,77.25 45.35,76.5 D10.1 45.1,76.38 43.73,75 v43.6,75 | v72.6,13 84.72,13 84.72,14.5 J1.13 | v43.6,50 42.98,50.62 U1.6 42.85,50.5 40.6,48.25 14.1,48.25 14.1,43 U2.6 | v16.85,82.12 7.72,91.25 5.47,91.25 5.1,91.62 J4.P5
  Bottom 0.3: v72.6,13 43.6,42 v43.6,50 43.6,55.38 33.79,65.19 | 33.79,65.19 v16.85,82.12 | 33.79,65.19 v43.6,75
SCL  (via drill 0.3)
  Top 0.3: R2_PINH.1 145.47,17.5 145.85,17.12 SENSOR2.4 149.47,17.12 153.85,21.5 v163.72,21.5 J3.4 | U3.16 76.16,72.81 | 76.16,72.81 67.6,64.25 45.85,64.25 44.35,62.75 17.85,62.75 17.85,60.5 U2.20 | v140.47,66.62 140.35,66.75 82.22,66.75 76.16,72.81 | v157.57,50.55 157.09,50.07 U4.8
  Bottom 0.3: v163.72,21.5 163.72,44.4 v157.57,50.55 157.55,50.55 141.47,66.62 v140.47,66.62
SDA  (via drill 0.3)
  Top 0.3: R1_PINH.1 145.47,13.5 148.22,16.25 149.35,16.25 SENSOR2.3 149.47,16.38 149.6,16.5 149.97,16.5 154.22,20.75 v163.1,20.75 163.97,19.88 164.35,19.88 J3.3 | v68.97,63.75 45.98,63.75 44.48,62.25 19.1,62.25 19.1,60.5 U2.19 | v77.47,72.25 77.47,73.38 77.97,73.38 U3.15 | v161.35,44.5 161.12,44.5 156.05,49.57 U4.7
  Bottom 0.3: v161.35,44.5 163.1,42.75 163.1,40.88 | v163.1,20.75 163.1,40.88 | v77.47,72.25 72.04,66.81 | 72.04,66.81 v68.97,63.75 | 163.1,40.88 142.47,40.88 142.47,49.88 125.6,66.75 72.1,66.75 72.04,66.81
SRC
  Top 0.3: 91.66,38.56 92.97,37.25 92.97,35.12 D5.2 | 91.66,38.56 90.35,39.88 90.35,44.5 C4.2 | L1.1 81.05,38.5 91.6,38.5 91.66,38.56
SS_SD  (via drill 0.3)
  Top 0.3: R10.1 61.23,66.75 60.1,65.62 46.1,65.62 45.23,66.5 D6.1 34.73,66.5 v31.6,63.38 | v13.1,44.88 11.47,44.88 11.47,43 U2.4 | J4.P2 13.35,80.5 v13.35,78.25
  Bottom 0.3: v31.6,63.38 29.91,61.69 | 29.91,61.69 v13.1,44.88 | 29.91,61.69 v13.35,78.25
TX
  Top 0.3: U2.25 11.47,60.5 11.47,65.38 11.6,65.38 TP1.TP
USB_D+  (via drill 0.3)
  Top 0.3: v70.1,47.88 106.72,47.88 106.97,48.12 D1.1 | v67.1,47.88 62.48,43.25 24.48,43.25 24.23,43 U2.14
  Bottom 0.3: v67.1,47.88 v70.1,47.88
USB_D-
  Top 0.3: D1.3 106.97,46.25 106.1,45.38 82.72,45.38 77.72,40.38 48.23,40.38 45.85,42.75 25.6,42.75 24.73,41.88 23.6,41.88 22.98,42.5 22.98,42.88 U2.13
VBAT  (via drill 0.3)  (1 unrouted)
  Top 0.3: Q1.3 71.85,29.88 74.85,32.88 100.97,32.88 TP4.TP 101.1,33 101.1,37.12 TP3.TP 101.22,37.12 108.85,44.75 v112.72,44.75 | U4.3 153.72,49.17 153.72,49.61 153.7,49.63 | 153.72,49.55 U4.2 153.28,49.66 141.94,49.66 v141.85,49.75 | v129.6,61.88 133.47,65.75 C2_BAT.1 | v128.72,60.62 128.6,60.5 127.72,60.5 MCP73831.3
  Bottom 0.3: v141.85,49.75 129.72,61.88 v129.6,61.88 128.72,61 v128.72,60.62 128.6,60.62 v112.72,44.75
VBUS  (via drill 0.3)
  Top 0.3: 112.91,59.81 113.47,60.38 124.97,60.38 MCP73831.4 125.22,60.5 125.97,61.25 132.85,61.25 133.47,60.62 C1_BAT.1 | 112.91,59.81 112.6,59.5 CHG_LED.A | 161.97,42.25 161.97,43.62 C5_USB.1 | 161.97,42.25 161.97,40.62 C4_USB.1 | 161.97,42.25 155.22,42.25 PFMF.050.1.2 155.1,42.38 150.22,47.25 113.35,47.25 | Q1.1 69.6,30.75 69.6,36.38 68.22,37.75 D2.2 68.1,37.88 v68.1,39.75 | v67.47,42.38 68.1,43 R1_PWRUSB.2 68.22,43.12 68.22,48.88 69.22,48.88 TP14.TP 69.22,48.75 107.97,48.75 107.97,48.38 108.85,47.5 109.22,47.5 109.47,47.25 D1.5 109.72,47.25 113.35,47.25 | v113.35,59.38 112.91,59.81 | v113.35,47.38 113.35,47.25
  Bottom 0.3: v68.1,39.75 67.47,40.38 v67.47,42.38 | v113.35,47.38 v113.35,59.38
VUSB  (via drill 0.3)
  Top 0.3: J2.A9 163.97,56.75 163.97,56.62 J2.B4 164.61,56.55 165.7,55.46 165.7,53.14 164.61,52.05 J2.B9 163.97,52 163.97,51.75 J2.A4 162.12,51.75 161.94,51.56 v154.6,51.56 | v151.85,43.5 150.72,42.38 PFMF.050.1.1
  Bottom 0.3: v151.85,43.5 151.85,50.95 152.5,51.6 154.56,51.6 v154.6,51.56